# Altium project Goldstrike1_Rev01.PrjPCB (part 2 of 4)

## Sheet GS_02_Pow.SchDoc: Title
size A3; Date: Date; CompanyName: Integrated Micro-Electronics Bulgaria; Organization: Design & Development Department; Address1: Drawing Type; Address2: Address 1; Address3: Address 2; Address4: Address 3; DocumentNumber: 730xxx; Revision: 01; SheetNumber: 1; SheetTotal: 1; PageSetup: Record=PageOptions|CenterHorizontal=True|CenterVertical=True|PrintScale=0.70|XCorrection=1.00|YCorrection=1.00|PrintKind=2|BorderSize=5000000|LeftOffset=0|BottomOffset=0|Orientation=2|PaperLength=1000|PaperWidth=1000|Scale=100|PaperSource=7|PrintQuality=-4|MediaType=1|DitherType=10|PaperKind=A4|PrintScaleMode=1; SheetSize: A3; Time: Time; ModifiedDate: Mod. Date
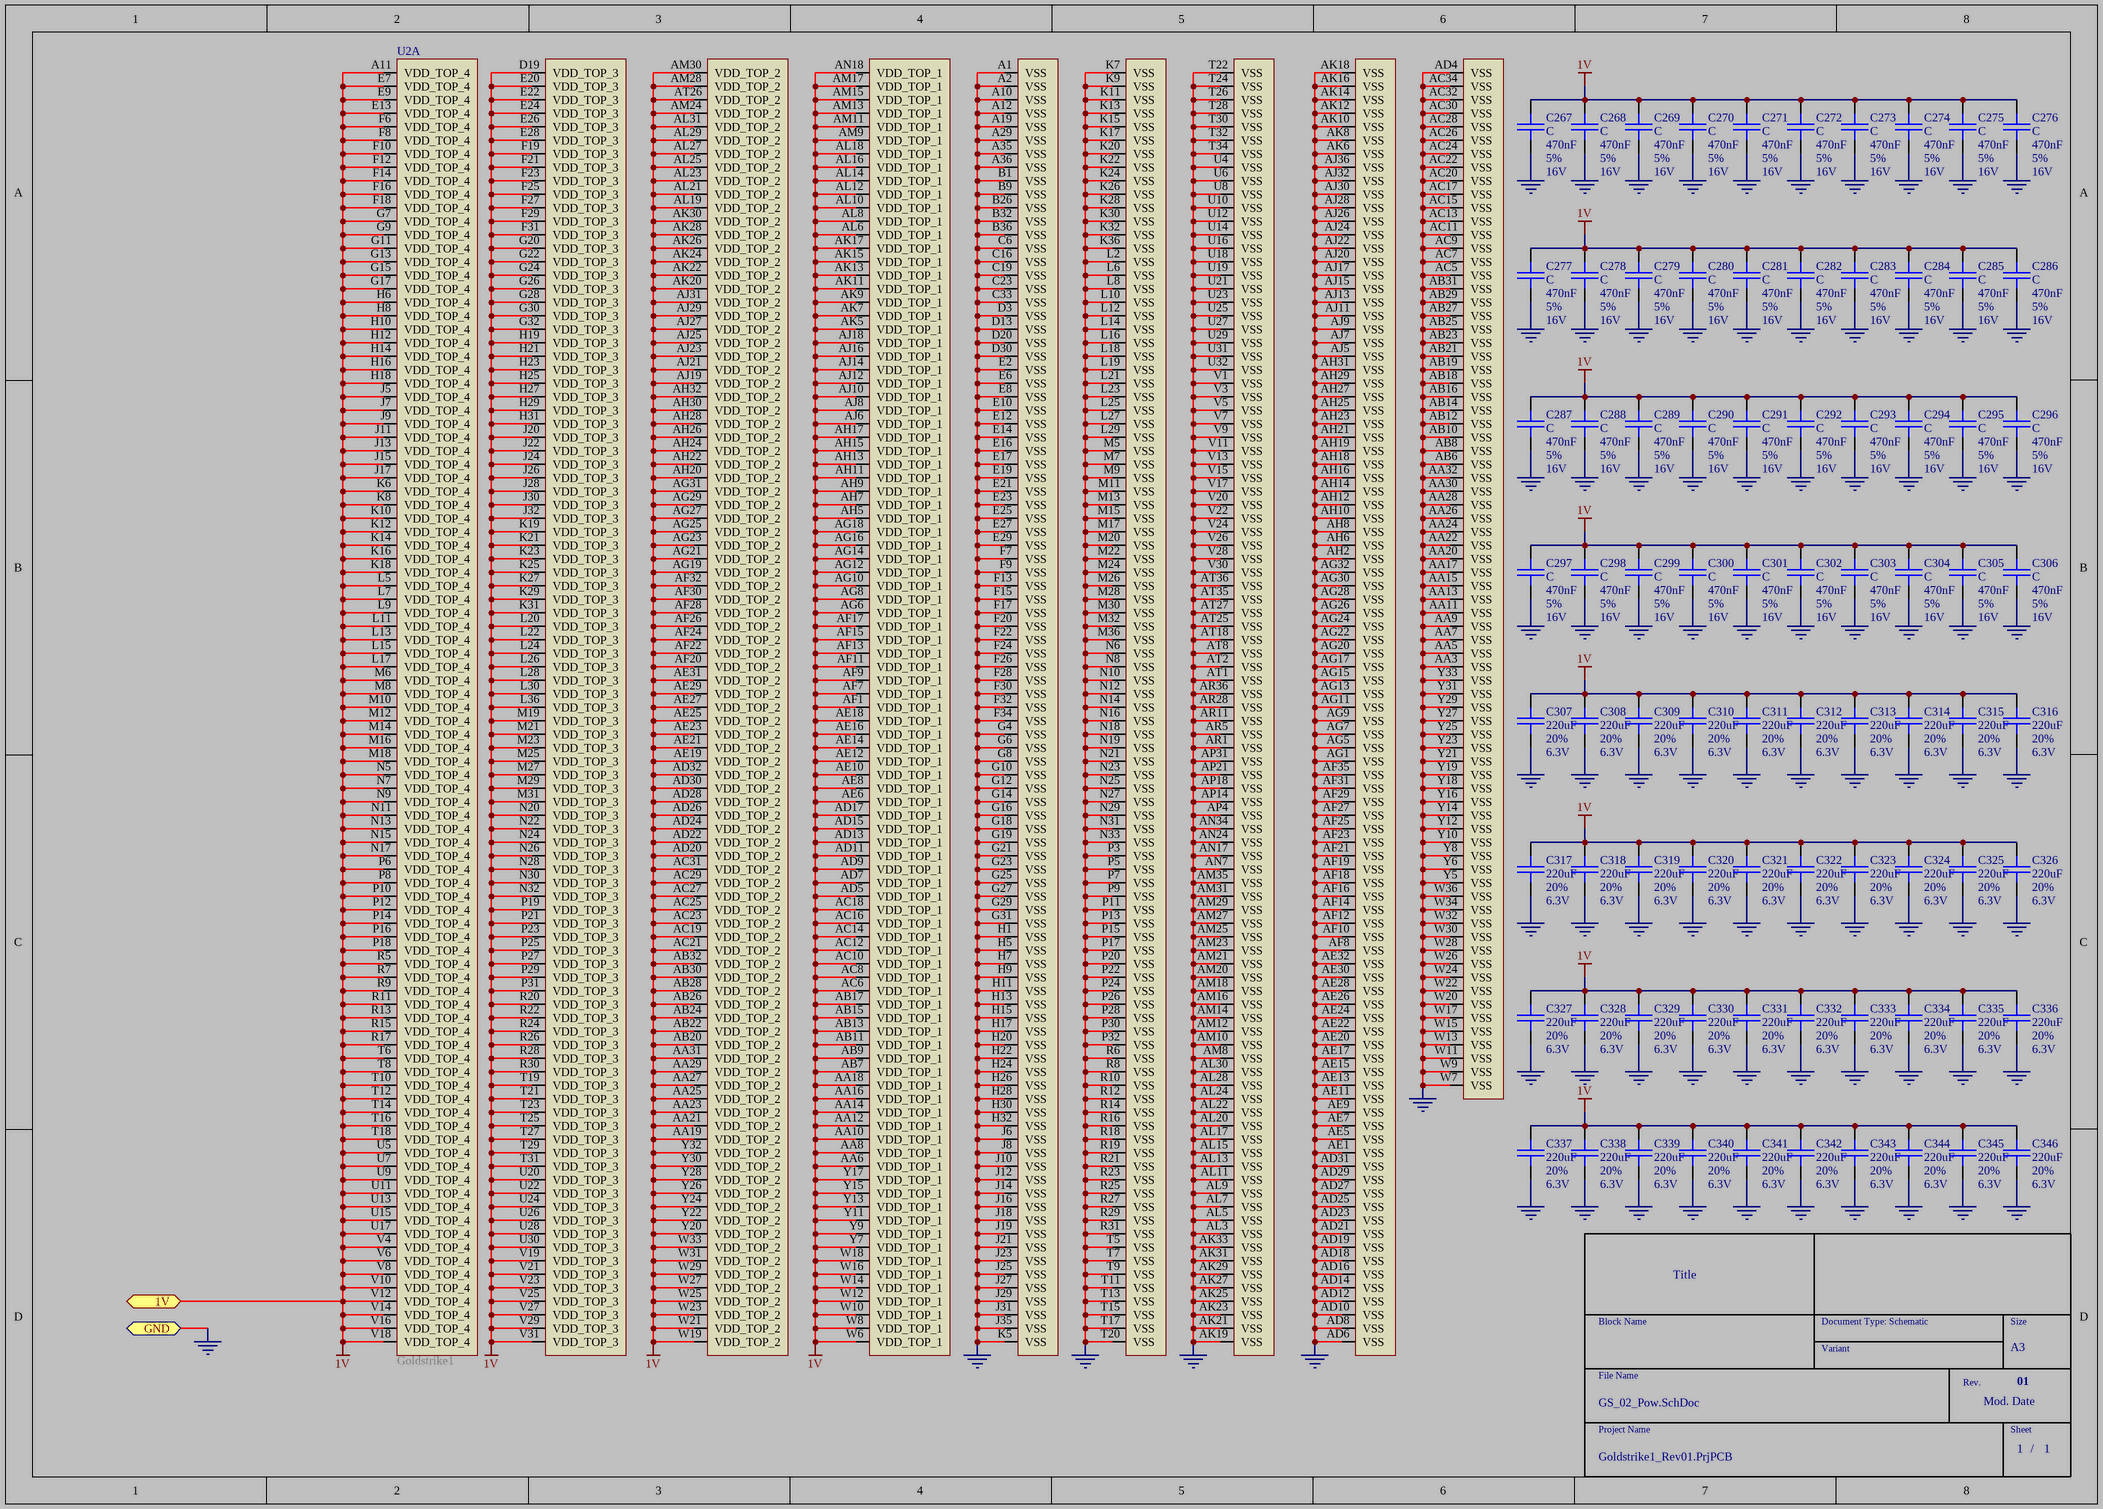
[diagram p3: GS_02_Pow.SchDoc]

### Parts
C267  C  DB_VALUE: 470nF  DB_TOLERANCE: 5%  DB_VOLTAGE: 16V  [SMD_0603_CAPC1608X95N]
C268  C  DB_VALUE: 470nF  DB_TOLERANCE: 5%  DB_VOLTAGE: 16V  [SMD_0603_CAPC1608X95N]
C269  C  DB_VALUE: 470nF  DB_TOLERANCE: 5%  DB_VOLTAGE: 16V  [SMD_0603_CAPC1608X95N]
C270  C  DB_VALUE: 470nF  DB_TOLERANCE: 5%  DB_VOLTAGE: 16V  [SMD_0603_CAPC1608X95N]
C271  C  DB_VALUE: 470nF  DB_TOLERANCE: 5%  DB_VOLTAGE: 16V  [SMD_0603_CAPC1608X95N]
C272  C  DB_VALUE: 470nF  DB_TOLERANCE: 5%  DB_VOLTAGE: 16V  [SMD_0603_CAPC1608X95N]
C273  C  DB_VALUE: 470nF  DB_TOLERANCE: 5%  DB_VOLTAGE: 16V  [SMD_0603_CAPC1608X95N]
C274  C  DB_VALUE: 470nF  DB_TOLERANCE: 5%  DB_VOLTAGE: 16V  [SMD_0603_CAPC1608X95N]
C275  C  DB_VALUE: 470nF  DB_TOLERANCE: 5%  DB_VOLTAGE: 16V  [SMD_0603_CAPC1608X95N]
C276  C  DB_VALUE: 470nF  DB_TOLERANCE: 5%  DB_VOLTAGE: 16V  [SMD_0603_CAPC1608X95N]
C277  C  DB_VALUE: 470nF  DB_TOLERANCE: 5%  DB_VOLTAGE: 16V  [SMD_0603_CAPC1608X95N]
C278  C  DB_VALUE: 470nF  DB_TOLERANCE: 5%  DB_VOLTAGE: 16V  [SMD_0603_CAPC1608X95N]
C279  C  DB_VALUE: 470nF  DB_TOLERANCE: 5%  DB_VOLTAGE: 16V  [SMD_0603_CAPC1608X95N]
C280  C  DB_VALUE: 470nF  DB_TOLERANCE: 5%  DB_VOLTAGE: 16V  [SMD_0603_CAPC1608X95N]
C281  C  DB_VALUE: 470nF  DB_TOLERANCE: 5%  DB_VOLTAGE: 16V  [SMD_0603_CAPC1608X95N]
C282  C  DB_VALUE: 470nF  DB_TOLERANCE: 5%  DB_VOLTAGE: 16V  [SMD_0603_CAPC1608X95N]
C283  C  DB_VALUE: 470nF  DB_TOLERANCE: 5%  DB_VOLTAGE: 16V  [SMD_0603_CAPC1608X95N]
C284  C  DB_VALUE: 470nF  DB_TOLERANCE: 5%  DB_VOLTAGE: 16V  [SMD_0603_CAPC1608X95N]
C285  C  DB_VALUE: 470nF  DB_TOLERANCE: 5%  DB_VOLTAGE: 16V  [SMD_0603_CAPC1608X95N]
C286  C  DB_VALUE: 470nF  DB_TOLERANCE: 5%  DB_VOLTAGE: 16V  [SMD_0603_CAPC1608X95N]
C287  C  DB_VALUE: 470nF  DB_TOLERANCE: 5%  DB_VOLTAGE: 16V  [SMD_0603_CAPC1608X95N]
C288  C  DB_VALUE: 470nF  DB_TOLERANCE: 5%  DB_VOLTAGE: 16V  [SMD_0603_CAPC1608X95N]
C289  C  DB_VALUE: 470nF  DB_TOLERANCE: 5%  DB_VOLTAGE: 16V  [SMD_0603_CAPC1608X95N]
C290  C  DB_VALUE: 470nF  DB_TOLERANCE: 5%  DB_VOLTAGE: 16V  [SMD_0603_CAPC1608X95N]
C291  C  DB_VALUE: 470nF  DB_TOLERANCE: 5%  DB_VOLTAGE: 16V  [SMD_0603_CAPC1608X95N]
C292  C  DB_VALUE: 470nF  DB_TOLERANCE: 5%  DB_VOLTAGE: 16V  [SMD_0603_CAPC1608X95N]
C293  C  DB_VALUE: 470nF  DB_TOLERANCE: 5%  DB_VOLTAGE: 16V  [SMD_0603_CAPC1608X95N]
C294  C  DB_VALUE: 470nF  DB_TOLERANCE: 5%  DB_VOLTAGE: 16V  [SMD_0603_CAPC1608X95N]
C295  C  DB_VALUE: 470nF  DB_TOLERANCE: 5%  DB_VOLTAGE: 16V  [SMD_0603_CAPC1608X95N]
C296  C  DB_VALUE: 470nF  DB_TOLERANCE: 5%  DB_VOLTAGE: 16V  [SMD_0603_CAPC1608X95N]
C297  C  DB_VALUE: 470nF  DB_TOLERANCE: 5%  DB_VOLTAGE: 16V  [SMD_0603_CAPC1608X95N]
C298  C  DB_VALUE: 470nF  DB_TOLERANCE: 5%  DB_VOLTAGE: 16V  [SMD_0603_CAPC1608X95N]
C299  C  DB_VALUE: 470nF  DB_TOLERANCE: 5%  DB_VOLTAGE: 16V  [SMD_0603_CAPC1608X95N]
C300  C  DB_VALUE: 470nF  DB_TOLERANCE: 5%  DB_VOLTAGE: 16V  [SMD_0603_CAPC1608X95N]
C301  C  DB_VALUE: 470nF  DB_TOLERANCE: 5%  DB_VOLTAGE: 16V  [SMD_0603_CAPC1608X95N]
C302  C  DB_VALUE: 470nF  DB_TOLERANCE: 5%  DB_VOLTAGE: 16V  [SMD_0603_CAPC1608X95N]
C303  C  DB_VALUE: 470nF  DB_TOLERANCE: 5%  DB_VOLTAGE: 16V  [SMD_0603_CAPC1608X95N]
C304  C  DB_VALUE: 470nF  DB_TOLERANCE: 5%  DB_VOLTAGE: 16V  [SMD_0603_CAPC1608X95N]
C305  C  DB_VALUE: 470nF  DB_TOLERANCE: 5%  DB_VOLTAGE: 16V  [SMD_0603_CAPC1608X95N]
C306  C  DB_VALUE: 470nF  DB_TOLERANCE: 5%  DB_VOLTAGE: 16V  [SMD_0603_CAPC1608X95N]
C307  DB_VALUE: 220uF  DB_TOLERANCE: 20%  DB_VOLTAGE: 6.3V  [SMD_1210_CAPC3225X279N]  (hidden comment: C)
C308  DB_VALUE: 220uF  DB_TOLERANCE: 20%  DB_VOLTAGE: 6.3V  [SMD_1210_CAPC3225X279N]  (hidden comment: C)
C309  DB_VALUE: 220uF  DB_TOLERANCE: 20%  DB_VOLTAGE: 6.3V  [SMD_1210_CAPC3225X279N]  (hidden comment: C)
C310  DB_VALUE: 220uF  DB_TOLERANCE: 20%  DB_VOLTAGE: 6.3V  [SMD_1210_CAPC3225X279N]  (hidden comment: C)
C311  DB_VALUE: 220uF  DB_TOLERANCE: 20%  DB_VOLTAGE: 6.3V  [SMD_1210_CAPC3225X279N]  (hidden comment: C)
C312  DB_VALUE: 220uF  DB_TOLERANCE: 20%  DB_VOLTAGE: 6.3V  [SMD_1210_CAPC3225X279N]  (hidden comment: C)
C313  DB_VALUE: 220uF  DB_TOLERANCE: 20%  DB_VOLTAGE: 6.3V  [SMD_1210_CAPC3225X279N]  (hidden comment: C)
C314  DB_VALUE: 220uF  DB_TOLERANCE: 20%  DB_VOLTAGE: 6.3V  [SMD_1210_CAPC3225X279N]  (hidden comment: C)
C315  DB_VALUE: 220uF  DB_TOLERANCE: 20%  DB_VOLTAGE: 6.3V  [SMD_1210_CAPC3225X279N]  (hidden comment: C)
C316  DB_VALUE: 220uF  DB_TOLERANCE: 20%  DB_VOLTAGE: 6.3V  [SMD_1210_CAPC3225X279N]  (hidden comment: C)
C317  DB_VALUE: 220uF  DB_TOLERANCE: 20%  DB_VOLTAGE: 6.3V  [SMD_1210_CAPC3225X279N]  (hidden comment: C)
C318  DB_VALUE: 220uF  DB_TOLERANCE: 20%  DB_VOLTAGE: 6.3V  [SMD_1210_CAPC3225X279N]  (hidden comment: C)
C319  DB_VALUE: 220uF  DB_TOLERANCE: 20%  DB_VOLTAGE: 6.3V  [SMD_1210_CAPC3225X279N]  (hidden comment: C)
C320  DB_VALUE: 220uF  DB_TOLERANCE: 20%  DB_VOLTAGE: 6.3V  [SMD_1210_CAPC3225X279N]  (hidden comment: C)
C321  DB_VALUE: 220uF  DB_TOLERANCE: 20%  DB_VOLTAGE: 6.3V  [SMD_1210_CAPC3225X279N]  (hidden comment: C)
C322  DB_VALUE: 220uF  DB_TOLERANCE: 20%  DB_VOLTAGE: 6.3V  [SMD_1210_CAPC3225X279N]  (hidden comment: C)
C323  DB_VALUE: 220uF  DB_TOLERANCE: 20%  DB_VOLTAGE: 6.3V  [SMD_1210_CAPC3225X279N]  (hidden comment: C)
C324  DB_VALUE: 220uF  DB_TOLERANCE: 20%  DB_VOLTAGE: 6.3V  [SMD_1210_CAPC3225X279N]  (hidden comment: C)
C325  DB_VALUE: 220uF  DB_TOLERANCE: 20%  DB_VOLTAGE: 6.3V  [SMD_1210_CAPC3225X279N]  (hidden comment: C)
C326  DB_VALUE: 220uF  DB_TOLERANCE: 20%  DB_VOLTAGE: 6.3V  [SMD_1210_CAPC3225X279N]  (hidden comment: C)
C327  DB_VALUE: 220uF  DB_TOLERANCE: 20%  DB_VOLTAGE: 6.3V  [SMD_1210_CAPC3225X279N]  (hidden comment: C)
C328  DB_VALUE: 220uF  DB_TOLERANCE: 20%  DB_VOLTAGE: 6.3V  [SMD_1210_CAPC3225X279N]  (hidden comment: C)
C329  DB_VALUE: 220uF  DB_TOLERANCE: 20%  DB_VOLTAGE: 6.3V  [SMD_1210_CAPC3225X279N]  (hidden comment: C)
C330  DB_VALUE: 220uF  DB_TOLERANCE: 20%  DB_VOLTAGE: 6.3V  [SMD_1210_CAPC3225X279N]  (hidden comment: C)
C331  DB_VALUE: 220uF  DB_TOLERANCE: 20%  DB_VOLTAGE: 6.3V  [SMD_1210_CAPC3225X279N]  (hidden comment: C)
C332  DB_VALUE: 220uF  DB_TOLERANCE: 20%  DB_VOLTAGE: 6.3V  [SMD_1210_CAPC3225X279N]  (hidden comment: C)
C333  DB_VALUE: 220uF  DB_TOLERANCE: 20%  DB_VOLTAGE: 6.3V  [SMD_1210_CAPC3225X279N]  (hidden comment: C)
C334  DB_VALUE: 220uF  DB_TOLERANCE: 20%  DB_VOLTAGE: 6.3V  [SMD_1210_CAPC3225X279N]  (hidden comment: C)
C335  DB_VALUE: 220uF  DB_TOLERANCE: 20%  DB_VOLTAGE: 6.3V  [SMD_1210_CAPC3225X279N]  (hidden comment: C)
C336  DB_VALUE: 220uF  DB_TOLERANCE: 20%  DB_VOLTAGE: 6.3V  [SMD_1210_CAPC3225X279N]  (hidden comment: C)
C337  DB_VALUE: 220uF  DB_TOLERANCE: 20%  DB_VOLTAGE: 6.3V  [SMD_1210_CAPC3225X279N]  (hidden comment: C)
C338  DB_VALUE: 220uF  DB_TOLERANCE: 20%  DB_VOLTAGE: 6.3V  [SMD_1210_CAPC3225X279N]  (hidden comment: C)
C339  DB_VALUE: 220uF  DB_TOLERANCE: 20%  DB_VOLTAGE: 6.3V  [SMD_1210_CAPC3225X279N]  (hidden comment: C)
C340  DB_VALUE: 220uF  DB_TOLERANCE: 20%  DB_VOLTAGE: 6.3V  [SMD_1210_CAPC3225X279N]  (hidden comment: C)
C341  DB_VALUE: 220uF  DB_TOLERANCE: 20%  DB_VOLTAGE: 6.3V  [SMD_1210_CAPC3225X279N]  (hidden comment: C)
C342  DB_VALUE: 220uF  DB_TOLERANCE: 20%  DB_VOLTAGE: 6.3V  [SMD_1210_CAPC3225X279N]  (hidden comment: C)
C343  DB_VALUE: 220uF  DB_TOLERANCE: 20%  DB_VOLTAGE: 6.3V  [SMD_1210_CAPC3225X279N]  (hidden comment: C)
C344  DB_VALUE: 220uF  DB_TOLERANCE: 20%  DB_VOLTAGE: 6.3V  [SMD_1210_CAPC3225X279N]  (hidden comment: C)
C345  DB_VALUE: 220uF  DB_TOLERANCE: 20%  DB_VOLTAGE: 6.3V  [SMD_1210_CAPC3225X279N]  (hidden comment: C)
C346  DB_VALUE: 220uF  DB_TOLERANCE: 20%  DB_VOLTAGE: 6.3V  [SMD_1210_CAPC3225X279N]  (hidden comment: C)
U2  Goldstrike1  [SMD_BGA1296C100P36X36]  (part A of 5)

### Ports
1V, GND

### Nets
1V: C267.2 C268.2 C269.2 C270.2 C271.2 C272.2 C273.2 C274.2 C275.2 C276.2 C277.2 C278.2 C279.2 C280.2 C281.2 C282.2 C283.2 C284.2 C285.2 C286.2 C287.2 C288.2 C289.2 C290.2 C291.2 C292.2 C293.2 C294.2 C295.2 C296.2 C297.2 C298.2 C299.2 C300.2 C301.2 C302.2 C303.2 C304.2 C305.2 C306.2 C307.2 C308.2 C309.2 C310.2 C311.2 C312.2 C313.2 C314.2 C315.2 C316.2 C317.2 C318.2 C319.2 C320.2 C321.2 C322.2 C323.2 C324.2 C325.2 C326.2 C327.2 C328.2 C329.2 C330.2 C331.2 C332.2 C333.2 C334.2 C335.2 C336.2 C337.2 C338.2 C339.2 C340.2 C341.2 C342.2 C343.2 C344.2 C345.2 C346.2 U2.A11(VDD_TOP_4) U2.AA6(VDD_TOP_1) U2.AA8(VDD_TOP_1) U2.AA10(VDD_TOP_1) U2.AA12(VDD_TOP_1) U2.AA14(VDD_TOP_1) U2.AA16(VDD_TOP_1) U2.AA18(VDD_TOP_1) U2.AA19(VDD_TOP_2) U2.AA21(VDD_TOP_2) U2.AA23(VDD_TOP_2) U2.AA25(VDD_TOP_2) U2.AA27(VDD_TOP_2) U2.AA29(VDD_TOP_2) U2.AA31(VDD_TOP_2) U2.AB7(VDD_TOP_1) U2.AB9(VDD_TOP_1) U2.AB11(VDD_TOP_1) U2.AB13(VDD_TOP_1) U2.AB15(VDD_TOP_1) U2.AB17(VDD_TOP_1) U2.AB20(VDD_TOP_2) U2.AB22(VDD_TOP_2) U2.AB24(VDD_TOP_2) U2.AB26(VDD_TOP_2) U2.AB28(VDD_TOP_2) U2.AB30(VDD_TOP_2) U2.AB32(VDD_TOP_2) U2.AC6(VDD_TOP_1) U2.AC8(VDD_TOP_1) U2.AC10(VDD_TOP_1) U2.AC12(VDD_TOP_1) U2.AC14(VDD_TOP_1) U2.AC16(VDD_TOP_1) U2.AC18(VDD_TOP_1) U2.AC19(VDD_TOP_2) U2.AC21(VDD_TOP_2) U2.AC23(VDD_TOP_2) U2.AC25(VDD_TOP_2) U2.AC27(VDD_TOP_2) U2.AC29(VDD_TOP_2) U2.AC31(VDD_TOP_2) U2.AD5(VDD_TOP_1) U2.AD7(VDD_TOP_1) U2.AD9(VDD_TOP_1) U2.AD11(VDD_TOP_1) U2.AD13(VDD_TOP_1) U2.AD15(VDD_TOP_1) U2.AD17(VDD_TOP_1) U2.AD20(VDD_TOP_2) U2.AD22(VDD_TOP_2) U2.AD24(VDD_TOP_2) U2.AD26(VDD_TOP_2) U2.AD28(VDD_TOP_2) U2.AD30(VDD_TOP_2) U2.AD32(VDD_TOP_2) U2.AE6(VDD_TOP_1) U2.AE8(VDD_TOP_1) U2.AE10(VDD_TOP_1) U2.AE12(VDD_TOP_1) U2.AE14(VDD_TOP_1) U2.AE16(VDD_TOP_1) U2.AE18(VDD_TOP_1) U2.AE19(VDD_TOP_2) U2.AE21(VDD_TOP_2) U2.AE23(VDD_TOP_2) U2.AE25(VDD_TOP_2) U2.AE27(VDD_TOP_2) U2.AE29(VDD_TOP_2) U2.AE31(VDD_TOP_2) U2.AF1(VDD_TOP_1) U2.AF7(VDD_TOP_1) U2.AF9(VDD_TOP_1) U2.AF11(VDD_TOP_1) U2.AF13(VDD_TOP_1) U2.AF15(VDD_TOP_1) U2.AF17(VDD_TOP_1) U2.AF20(VDD_TOP_2) U2.AF22(VDD_TOP_2) U2.AF24(VDD_TOP_2) U2.AF26(VDD_TOP_2) U2.AF28(VDD_TOP_2) U2.AF30(VDD_TOP_2) U2.AF32(VDD_TOP_2) U2.AG6(VDD_TOP_1) U2.AG8(VDD_TOP_1) U2.AG10(VDD_TOP_1) U2.AG12(VDD_TOP_1) U2.AG14(VDD_TOP_1) U2.AG16(VDD_TOP_1) U2.AG18(VDD_TOP_1) U2.AG19(VDD_TOP_2) U2.AG21(VDD_TOP_2) U2.AG23(VDD_TOP_2) U2.AG25(VDD_TOP_2) U2.AG27(VDD_TOP_2) U2.AG29(VDD_TOP_2) U2.AG31(VDD_TOP_2) U2.AH5(VDD_TOP_1) U2.AH7(VDD_TOP_1) U2.AH9(VDD_TOP_1) U2.AH11(VDD_TOP_1) U2.AH13(VDD_TOP_1) U2.AH15(VDD_TOP_1) U2.AH17(VDD_TOP_1) U2.AH20(VDD_TOP_2) U2.AH22(VDD_TOP_2) U2.AH24(VDD_TOP_2) U2.AH26(VDD_TOP_2) U2.AH28(VDD_TOP_2) U2.AH30(VDD_TOP_2) U2.AH32(VDD_TOP_2) U2.AJ6(VDD_TOP_1) U2.AJ8(VDD_TOP_1) U2.AJ10(VDD_TOP_1) U2.AJ12(VDD_TOP_1) U2.AJ14(VDD_TOP_1) U2.AJ16(VDD_TOP_1) U2.AJ18(VDD_TOP_1) U2.AJ19(VDD_TOP_2) U2.AJ21(VDD_TOP_2) U2.AJ23(VDD_TOP_2) U2.AJ25(VDD_TOP_2) U2.AJ27(VDD_TOP_2) U2.AJ29(VDD_TOP_2) U2.AJ31(VDD_TOP_2) U2.AK5(VDD_TOP_1) U2.AK7(VDD_TOP_1) U2.AK9(VDD_TOP_1) U2.AK11(VDD_TOP_1) U2.AK13(VDD_TOP_1) U2.AK15(VDD_TOP_1) U2.AK17(VDD_TOP_1) U2.AK20(VDD_TOP_2) U2.AK22(VDD_TOP_2) U2.AK24(VDD_TOP_2) U2.AK26(VDD_TOP_2) U2.AK28(VDD_TOP_2) U2.AK30(VDD_TOP_2) U2.AL6(VDD_TOP_1) U2.AL8(VDD_TOP_1) U2.AL10(VDD_TOP_1) U2.AL12(VDD_TOP_1) U2.AL14(VDD_TOP_1) U2.AL16(VDD_TOP_1) U2.AL18(VDD_TOP_1) U2.AL19(VDD_TOP_2) U2.AL21(VDD_TOP_2) U2.AL23(VDD_TOP_2) U2.AL25(VDD_TOP_2) U2.AL27(VDD_TOP_2) U2.AL29(VDD_TOP_2) U2.AL31(VDD_TOP_2) U2.AM9(VDD_TOP_1) U2.AM11(VDD_TOP_1) U2.AM13(VDD_TOP_1) U2.AM15(VDD_TOP_1) U2.AM17(VDD_TOP_1) U2.AM24(VDD_TOP_2) U2.AM28(VDD_TOP_2) U2.AM30(VDD_TOP_2) U2.AN18(VDD_TOP_1) U2.AT26(VDD_TOP_2) U2.D19(VDD_TOP_3) U2.E7(VDD_TOP_4) U2.E9(VDD_TOP_4) U2.E13(VDD_TOP_4) U2.E20(VDD_TOP_3) U2.E22(VDD_TOP_3) U2.E24(VDD_TOP_3) U2.E26(VDD_TOP_3) U2.E28(VDD_TOP_3) U2.F6(VDD_TOP_4) U2.F8(VDD_TOP_4) U2.F10(VDD_TOP_4) U2.F12(VDD_TOP_4) U2.F14(VDD_TOP_4) U2.F16(VDD_TOP_4) U2.F18(VDD_TOP_4) U2.F19(VDD_TOP_3) U2.F21(VDD_TOP_3) U2.F23(VDD_TOP_3) U2.F25(VDD_TOP_3) U2.F27(VDD_TOP_3) U2.F29(VDD_TOP_3) U2.F31(VDD_TOP_3) U2.G7(VDD_TOP_4) U2.G9(VDD_TOP_4) U2.G11(VDD_TOP_4) U2.G13(VDD_TOP_4) U2.G15(VDD_TOP_4) U2.G17(VDD_TOP_4) U2.G20(VDD_TOP_3) U2.G22(VDD_TOP_3) U2.G24(VDD_TOP_3) U2.G26(VDD_TOP_3) U2.G28(VDD_TOP_3) U2.G30(VDD_TOP_3) U2.G32(VDD_TOP_3) U2.H6(VDD_TOP_4) U2.H8(VDD_TOP_4) U2.H10(VDD_TOP_4) U2.H12(VDD_TOP_4) U2.H14(VDD_TOP_4) U2.H16(VDD_TOP_4) U2.H18(VDD_TOP_4) U2.H19(VDD_TOP_3) U2.H21(VDD_TOP_3) U2.H23(VDD_TOP_3) U2.H25(VDD_TOP_3) U2.H27(VDD_TOP_3) U2.H29(VDD_TOP_3) U2.H31(VDD_TOP_3) U2.J5(VDD_TOP_4) U2.J7(VDD_TOP_4) U2.J9(VDD_TOP_4) U2.J11(VDD_TOP_4) U2.J13(VDD_TOP_4) U2.J15(VDD_TOP_4) U2.J17(VDD_TOP_4) U2.J20(VDD_TOP_3) U2.J22(VDD_TOP_3) U2.J24(VDD_TOP_3) U2.J26(VDD_TOP_3) U2.J28(VDD_TOP_3) U2.J30(VDD_TOP_3) U2.J32(VDD_TOP_3) U2.K6(VDD_TOP_4) U2.K8(VDD_TOP_4) U2.K10(VDD_TOP_4) U2.K12(VDD_TOP_4) U2.K14(VDD_TOP_4) U2.K16(VDD_TOP_4) U2.K18(VDD_TOP_4) U2.K19(VDD_TOP_3) U2.K21(VDD_TOP_3) U2.K23(VDD_TOP_3) U2.K25(VDD_TOP_3) U2.K27(VDD_TOP_3) U2.K29(VDD_TOP_3) U2.K31(VDD_TOP_3) U2.L5(VDD_TOP_4) U2.L7(VDD_TOP_4) U2.L9(VDD_TOP_4) U2.L11(VDD_TOP_4) U2.L13(VDD_TOP_4) U2.L15(VDD_TOP_4) U2.L17(VDD_TOP_4) U2.L20(VDD_TOP_3) U2.L22(VDD_TOP_3) U2.L24(VDD_TOP_3) U2.L26(VDD_TOP_3) U2.L28(VDD_TOP_3) U2.L30(VDD_TOP_3) U2.L36(VDD_TOP_3) U2.M6(VDD_TOP_4) U2.M8(VDD_TOP_4) U2.M10(VDD_TOP_4) U2.M12(VDD_TOP_4) U2.M14(VDD_TOP_4) U2.M16(VDD_TOP_4) U2.M18(VDD_TOP_4) U2.M19(VDD_TOP_3) U2.M21(VDD_TOP_3) U2.M23(VDD_TOP_3) U2.M25(VDD_TOP_3) U2.M27(VDD_TOP_3) U2.M29(VDD_TOP_3) U2.M31(VDD_TOP_3) U2.N5(VDD_TOP_4) U2.N7(VDD_TOP_4) U2.N9(VDD_TOP_4) U2.N11(VDD_TOP_4) U2.N13(VDD_TOP_4) U2.N15(VDD_TOP_4) U2.N17(VDD_TOP_4) U2.N20(VDD_TOP_3) U2.N22(VDD_TOP_3) U2.N24(VDD_TOP_3) U2.N26(VDD_TOP_3) U2.N28(VDD_TOP_3) U2.N30(VDD_TOP_3) U2.N32(VDD_TOP_3) U2.P6(VDD_TOP_4) U2.P8(VDD_TOP_4) U2.P10(VDD_TOP_4) U2.P12(VDD_TOP_4) U2.P14(VDD_TOP_4) U2.P16(VDD_TOP_4) U2.P18(VDD_TOP_4) U2.P19(VDD_TOP_3) U2.P21(VDD_TOP_3) U2.P23(VDD_TOP_3) U2.P25(VDD_TOP_3) U2.P27(VDD_TOP_3) U2.P29(VDD_TOP_3) U2.P31(VDD_TOP_3) U2.R5(VDD_TOP_4) U2.R7(VDD_TOP_4) U2.R9(VDD_TOP_4) U2.R11(VDD_TOP_4) U2.R13(VDD_TOP_4) U2.R15(VDD_TOP_4) U2.R17(VDD_TOP_4) U2.R20(VDD_TOP_3) U2.R22(VDD_TOP_3) U2.R24(VDD_TOP_3) U2.R26(VDD_TOP_3) U2.R28(VDD_TOP_3) U2.R30(VDD_TOP_3) U2.T6(VDD_TOP_4) U2.T8(VDD_TOP_4) U2.T10(VDD_TOP_4) U2.T12(VDD_TOP_4) U2.T14(VDD_TOP_4) U2.T16(VDD_TOP_4) U2.T18(VDD_TOP_4) U2.T19(VDD_TOP_3) U2.T21(VDD_TOP_3) U2.T23(VDD_TOP_3) U2.T25(VDD_TOP_3) U2.T27(VDD_TOP_3) U2.T29(VDD_TOP_3) U2.T31(VDD_TOP_3) U2.U5(VDD_TOP_4) U2.U7(VDD_TOP_4) U2.U9(VDD_TOP_4) U2.U11(VDD_TOP_4) U2.U13(VDD_TOP_4) U2.U15(VDD_TOP_4) U2.U17(VDD_TOP_4) U2.U20(VDD_TOP_3) U2.U22(VDD_TOP_3) U2.U24(VDD_TOP_3) U2.U26(VDD_TOP_3) U2.U28(VDD_TOP_3) U2.U30(VDD_TOP_3) U2.V4(VDD_TOP_4) U2.V6(VDD_TOP_4) U2.V8(VDD_TOP_4) U2.V10(VDD_TOP_4) U2.V12(VDD_TOP_4) U2.V14(VDD_TOP_4) U2.V16(VDD_TOP_4) U2.V18(VDD_TOP_4) U2.V19(VDD_TOP_3) U2.V21(VDD_TOP_3) U2.V23(VDD_TOP_3) U2.V25(VDD_TOP_3) U2.V27(VDD_TOP_3) U2.V29(VDD_TOP_3) U2.V31(VDD_TOP_3) U2.W6(VDD_TOP_1) U2.W8(VDD_TOP_1) U2.W10(VDD_TOP_1) U2.W12(VDD_TOP_1) U2.W14(VDD_TOP_1) U2.W16(VDD_TOP_1) U2.W18(VDD_TOP_1) U2.W19(VDD_TOP_2) U2.W21(VDD_TOP_2) U2.W23(VDD_TOP_2) U2.W25(VDD_TOP_2) U2.W27(VDD_TOP_2) U2.W29(VDD_TOP_2) U2.W31(VDD_TOP_2) U2.W33(VDD_TOP_2) U2.Y7(VDD_TOP_1) U2.Y9(VDD_TOP_1) U2.Y11(VDD_TOP_1) U2.Y13(VDD_TOP_1) U2.Y15(VDD_TOP_1) U2.Y17(VDD_TOP_1) U2.Y20(VDD_TOP_2) U2.Y22(VDD_TOP_2) U2.Y24(VDD_TOP_2) U2.Y26(VDD_TOP_2) U2.Y28(VDD_TOP_2) U2.Y30(VDD_TOP_2) U2.Y32(VDD_TOP_2) ; port 1V
GND: C267.1 C268.1 C269.1 C270.1 C271.1 C272.1 C273.1 C274.1 C275.1 C276.1 C277.1 C278.1 C279.1 C280.1 C281.1 C282.1 C283.1 C284.1 C285.1 C286.1 C287.1 C288.1 C289.1 C290.1 C291.1 C292.1 C293.1 C294.1 C295.1 C296.1 C297.1 C298.1 C299.1 C300.1 C301.1 C302.1 C303.1 C304.1 C305.1 C306.1 C307.1 C308.1 C309.1 C310.1 C311.1 C312.1 C313.1 C314.1 C315.1 C316.1 C317.1 C318.1 C319.1 C320.1 C321.1 C322.1 C323.1 C324.1 C325.1 C326.1 C327.1 C328.1 C329.1 C330.1 C331.1 C332.1 C333.1 C334.1 C335.1 C336.1 C337.1 C338.1 C339.1 C340.1 C341.1 C342.1 C343.1 C344.1 C345.1 C346.1 U2.A1(VSS) U2.A2(VSS) U2.A10(VSS) U2.A12(VSS) U2.A19(VSS) U2.A29(VSS) U2.A35(VSS) U2.A36(VSS) U2.AA3(VSS) U2.AA5(VSS) U2.AA7(VSS) U2.AA9(VSS) U2.AA11(VSS) U2.AA13(VSS) U2.AA15(VSS) U2.AA17(VSS) U2.AA20(VSS) U2.AA22(VSS) U2.AA24(VSS) U2.AA26(VSS) U2.AA28(VSS) U2.AA30(VSS) U2.AA32(VSS) U2.AB6(VSS) U2.AB8(VSS) U2.AB10(VSS) U2.AB12(VSS) U2.AB14(VSS) U2.AB16(VSS) U2.AB18(VSS) U2.AB19(VSS) U2.AB21(VSS) U2.AB23(VSS) U2.AB25(VSS) U2.AB27(VSS) U2.AB29(VSS) U2.AB31(VSS) U2.AC5(VSS) U2.AC7(VSS) U2.AC9(VSS) U2.AC11(VSS) U2.AC13(VSS) U2.AC15(VSS) U2.AC17(VSS) U2.AC20(VSS) U2.AC22(VSS) U2.AC24(VSS) U2.AC26(VSS) U2.AC28(VSS) U2.AC30(VSS) U2.AC32(VSS) U2.AC34(VSS) U2.AD4(VSS) U2.AD6(VSS) U2.AD8(VSS) U2.AD10(VSS) U2.AD12(VSS) U2.AD14(VSS) U2.AD16(VSS) U2.AD18(VSS) U2.AD19(VSS) U2.AD21(VSS) U2.AD23(VSS) U2.AD25(VSS) U2.AD27(VSS) U2.AD29(VSS) U2.AD31(VSS) U2.AE1(VSS) U2.AE5(VSS) U2.AE7(VSS) U2.AE9(VSS) U2.AE11(VSS) U2.AE13(VSS) U2.AE15(VSS) U2.AE17(VSS) U2.AE20(VSS) U2.AE22(VSS) U2.AE24(VSS) U2.AE26(VSS) U2.AE28(VSS) U2.AE30(VSS) U2.AE32(VSS) U2.AF8(VSS) U2.AF10(VSS) U2.AF12(VSS) U2.AF14(VSS) U2.AF16(VSS) U2.AF18(VSS) U2.AF19(VSS) U2.AF21(VSS) U2.AF23(VSS) U2.AF25(VSS) U2.AF27(VSS) U2.AF29(VSS) U2.AF31(VSS) U2.AF35(VSS) U2.AG1(VSS) U2.AG5(VSS) U2.AG7(VSS) U2.AG9(VSS) U2.AG11(VSS) U2.AG13(VSS) U2.AG15(VSS) U2.AG17(VSS) U2.AG20(VSS) U2.AG22(VSS) U2.AG24(VSS) U2.AG26(VSS) U2.AG28(VSS) U2.AG30(VSS) U2.AG32(VSS) U2.AH2(VSS) U2.AH6(VSS) U2.AH8(VSS) U2.AH10(VSS) U2.AH12(VSS) U2.AH14(VSS) U2.AH16(VSS) U2.AH18(VSS) U2.AH19(VSS) U2.AH21(VSS) U2.AH23(VSS) U2.AH25(VSS) U2.AH27(VSS) U2.AH29(VSS) U2.AH31(VSS) U2.AJ5(VSS) U2.AJ7(VSS) U2.AJ9(VSS) U2.AJ11(VSS) U2.AJ13(VSS) U2.AJ15(VSS) U2.AJ17(VSS) U2.AJ20(VSS) U2.AJ22(VSS) U2.AJ24(VSS) U2.AJ26(VSS) U2.AJ28(VSS) U2.AJ30(VSS) U2.AJ32(VSS) U2.AJ36(VSS) U2.AK6(VSS) U2.AK8(VSS) U2.AK10(VSS) U2.AK12(VSS) U2.AK14(VSS) U2.AK16(VSS) U2.AK18(VSS) U2.AK19(VSS) U2.AK21(VSS) U2.AK23(VSS) U2.AK25(VSS) U2.AK27(VSS) U2.AK29(VSS) U2.AK31(VSS) U2.AK33(VSS) U2.AL3(VSS) U2.AL5(VSS) U2.AL7(VSS) U2.AL9(VSS) U2.AL11(VSS) U2.AL13(VSS) U2.AL15(VSS) U2.AL17(VSS) U2.AL20(VSS) U2.AL22(VSS) U2.AL24(VSS) U2.AL28(VSS) U2.AL30(VSS) U2.AM8(VSS) U2.AM10(VSS) U2.AM12(VSS) U2.AM14(VSS) U2.AM16(VSS) U2.AM18(VSS) U2.AM20(VSS) U2.AM21(VSS) U2.AM23(VSS) U2.AM25(VSS) U2.AM27(VSS) U2.AM29(VSS) U2.AM31(VSS) U2.AM35(VSS) U2.AN7(VSS) U2.AN17(VSS) U2.AN24(VSS) U2.AN34(VSS) U2.AP4(VSS) U2.AP14(VSS) U2.AP18(VSS) U2.AP21(VSS) U2.AP31(VSS) U2.AR1(VSS) U2.AR5(VSS) U2.AR11(VSS) U2.AR28(VSS) U2.AR36(VSS) U2.AT1(VSS) U2.AT2(VSS) U2.AT8(VSS) U2.AT18(VSS) U2.AT25(VSS) U2.AT27(VSS) U2.AT35(VSS) U2.AT36(VSS) U2.B1(VSS) U2.B9(VSS) U2.B26(VSS) U2.B32(VSS) U2.B36(VSS) U2.C6(VSS) U2.C16(VSS) U2.C19(VSS) U2.C23(VSS) U2.C33(VSS) U2.D3(VSS) U2.D13(VSS) U2.D20(VSS) U2.D30(VSS) U2.E2(VSS) U2.E6(VSS) U2.E8(VSS) U2.E10(VSS) U2.E12(VSS) U2.E14(VSS) U2.E16(VSS) U2.E17(VSS) U2.E19(VSS) U2.E21(VSS) U2.E23(VSS) U2.E25(VSS) U2.E27(VSS) U2.E29(VSS) U2.F7(VSS) U2.F9(VSS) U2.F13(VSS) U2.F15(VSS) U2.F17(VSS) U2.F20(VSS) U2.F22(VSS) U2.F24(VSS) U2.F26(VSS) U2.F28(VSS) U2.F30(VSS) U2.F32(VSS) U2.F34(VSS) U2.G4(VSS) U2.G6(VSS) U2.G8(VSS) U2.G10(VSS) U2.G12(VSS) U2.G14(VSS) U2.G16(VSS) U2.G18(VSS) U2.G19(VSS) U2.G21(VSS) U2.G23(VSS) U2.G25(VSS) U2.G27(VSS) U2.G29(VSS) U2.G31(VSS) U2.H1(VSS) U2.H5(VSS) U2.H7(VSS) U2.H9(VSS) U2.H11(VSS) U2.H13(VSS) U2.H15(VSS) U2.H17(VSS) U2.H20(VSS) U2.H22(VSS) U2.H24(VSS) U2.H26(VSS) U2.H28(VSS) U2.H30(VSS) U2.H32(VSS) U2.J6(VSS) U2.J8(VSS) U2.J10(VSS) U2.J12(VSS) U2.J14(VSS) U2.J16(VSS) U2.J18(VSS) U2.J19(VSS) U2.J21(VSS) U2.J23(VSS) U2.J25(VSS) U2.J27(VSS) U2.J29(VSS) U2.J31(VSS) U2.J35(VSS) U2.K5(VSS) U2.K7(VSS) U2.K9(VSS) U2.K11(VSS) U2.K13(VSS) U2.K15(VSS) U2.K17(VSS) U2.K20(VSS) U2.K22(VSS) U2.K24(VSS) U2.K26(VSS) U2.K28(VSS) U2.K30(VSS) U2.K32(VSS) U2.K36(VSS) U2.L2(VSS) U2.L6(VSS) U2.L8(VSS) U2.L10(VSS) U2.L12(VSS) U2.L14(VSS) U2.L16(VSS) U2.L18(VSS) U2.L19(VSS) U2.L21(VSS) U2.L23(VSS) U2.L25(VSS) U2.L27(VSS) U2.L29(VSS) U2.M5(VSS) U2.M7(VSS) U2.M9(VSS) U2.M11(VSS) U2.M13(VSS) U2.M15(VSS) U2.M17(VSS) U2.M20(VSS) U2.M22(VSS) U2.M24(VSS) U2.M26(VSS) U2.M28(VSS) U2.M30(VSS) U2.M32(VSS) U2.M36(VSS) U2.N6(VSS) U2.N8(VSS) U2.N10(VSS) U2.N12(VSS) U2.N14(VSS) U2.N16(VSS) U2.N18(VSS) U2.N19(VSS) U2.N21(VSS) U2.N23(VSS) U2.N25(VSS) U2.N27(VSS) U2.N29(VSS) U2.N31(VSS) U2.N33(VSS) U2.P3(VSS) U2.P5(VSS) U2.P7(VSS) U2.P9(VSS) U2.P11(VSS) U2.P13(VSS) U2.P15(VSS) U2.P17(VSS) U2.P20(VSS) U2.P22(VSS) U2.P24(VSS) U2.P26(VSS) U2.P28(VSS) U2.P30(VSS) U2.P32(VSS) U2.R6(VSS) U2.R8(VSS) U2.R10(VSS) U2.R12(VSS) U2.R14(VSS) U2.R16(VSS) U2.R18(VSS) U2.R19(VSS) U2.R21(VSS) U2.R23(VSS) U2.R25(VSS) U2.R27(VSS) U2.R29(VSS) U2.R31(VSS) U2.T5(VSS) U2.T7(VSS) U2.T9(VSS) U2.T11(VSS) U2.T13(VSS) U2.T15(VSS) U2.T17(VSS) U2.T20(VSS) U2.T22(VSS) U2.T24(VSS) U2.T26(VSS) U2.T28(VSS) U2.T30(VSS) U2.T32(VSS) U2.T34(VSS) U2.U4(VSS) U2.U6(VSS) U2.U8(VSS) U2.U10(VSS) U2.U12(VSS) U2.U14(VSS) U2.U16(VSS) U2.U18(VSS) U2.U19(VSS) U2.U21(VSS) U2.U23(VSS) U2.U25(VSS) U2.U27(VSS) U2.U29(VSS) U2.U31(VSS) U2.U32(VSS) U2.V1(VSS) U2.V3(VSS) U2.V5(VSS) U2.V7(VSS) U2.V9(VSS) U2.V11(VSS) U2.V13(VSS) U2.V15(VSS) U2.V17(VSS) U2.V20(VSS) U2.V22(VSS) U2.V24(VSS) U2.V26(VSS) U2.V28(VSS) U2.V30(VSS) U2.W7(VSS) U2.W9(VSS) U2.W11(VSS) U2.W13(VSS) U2.W15(VSS) U2.W17(VSS) U2.W20(VSS) U2.W22(VSS) U2.W24(VSS) U2.W26(VSS) U2.W28(VSS) U2.W30(VSS) U2.W32(VSS) U2.W34(VSS) U2.W36(VSS) U2.Y5(VSS) U2.Y6(VSS) U2.Y8(VSS) U2.Y10(VSS) U2.Y12(VSS) U2.Y14(VSS) U2.Y16(VSS) U2.Y18(VSS) U2.Y19(VSS) U2.Y21(VSS) U2.Y23(VSS) U2.Y25(VSS) U2.Y27(VSS) U2.Y29(VSS) U2.Y31(VSS) U2.Y33(VSS) ; port GND

### Notes on the sheet
- Block Name
- Document Type: Schematic
- Size
- File Name
- Variant
- Rev.
- Project Name
- Sheet
- /

### Library data of the parts
C267-C306 = CAP000028169: DB_PART_TYPE: Ceramic_SMD\Standard_X7R; DB_MANUFACTURER_PART: KEMET    C0603C474J4RAC; NOTE: <NOTE>; DB_T_RANGE: -55 to 125; DB_PACKAGE: 0603; DB_DESCRIPTION: C X7R 470nF 5% 16V 0603; DB_APPROVED_ON: 09.10.2010 г.; DB_STATUS: NEW; DB_PART_NUMBER: CAP000028169; DB_PCB_DEVICE: SMD_0603_CAPC1608X95N; DB_DATASHEET: http://john.epiqdesign.com/projects/CIS_Datasheets/F3102_CE_Kemet.pdf?rev=92&sc=0
C307-C346 = CAP000047355: DB_PART_TYPE: Ceramic_SMD\Standard_X5R; DB_MANUFACTURER_PART: SAMSUNG    CL32A227MQVNNNE; NOTE: <NOTE>; DB_T_RANGE: -55 to 85; DB_PACKAGE: 1210; DB_DESCRIPTION: C X5R 220uF 20% 6.3V 1210; DB_APPROVED_BY: VSN; DB_APPROVED_ON: 07.5.2014 г. 11:28:08; DB_STATUS: NEW; DB_PART_NUMBER: CAP000047355; DB_PCB_DEVICE: SMD_1210_CAPC3225X279N; DB_DATASHEET: http://john.epiqdesign.com/projects/CIS_Datasheets/CAP_CL32A227MQVNNNE.pdf?rev=1401&sc=0
U2 = Goldstrike1: DB_PCB_DEVICE: SMD_BGA1296C100P36X36

## Sheet MCU.SchDoc: Title
size A2; Date: Date; CompanyName: Integrated Micro-Electronics Bulgaria; Organization: Design & Development Department; Address1: Drawing Type; Address2: Address 1; Address3: Address 2; Address4: Address 3; DocumentNumber: 730xxx; Revision: 01; SheetNumber: 1; SheetTotal: 1; PageSetup: Record=PageOptions|CenterHorizontal=True|CenterVertical=True|PrintScale=0.70|XCorrection=1.00|YCorrection=1.00|PrintKind=2|BorderSize=5000000|LeftOffset=0|BottomOffset=0|Orientation=2|PaperLength=1000|PaperWidth=1000|Scale=100|PaperSource=7|PrintQuality=-4|MediaType=1|DitherType=10|PaperKind=A4|PrintScaleMode=1; SheetSize: A3; Time: Time; ModifiedDate: Mod. Date
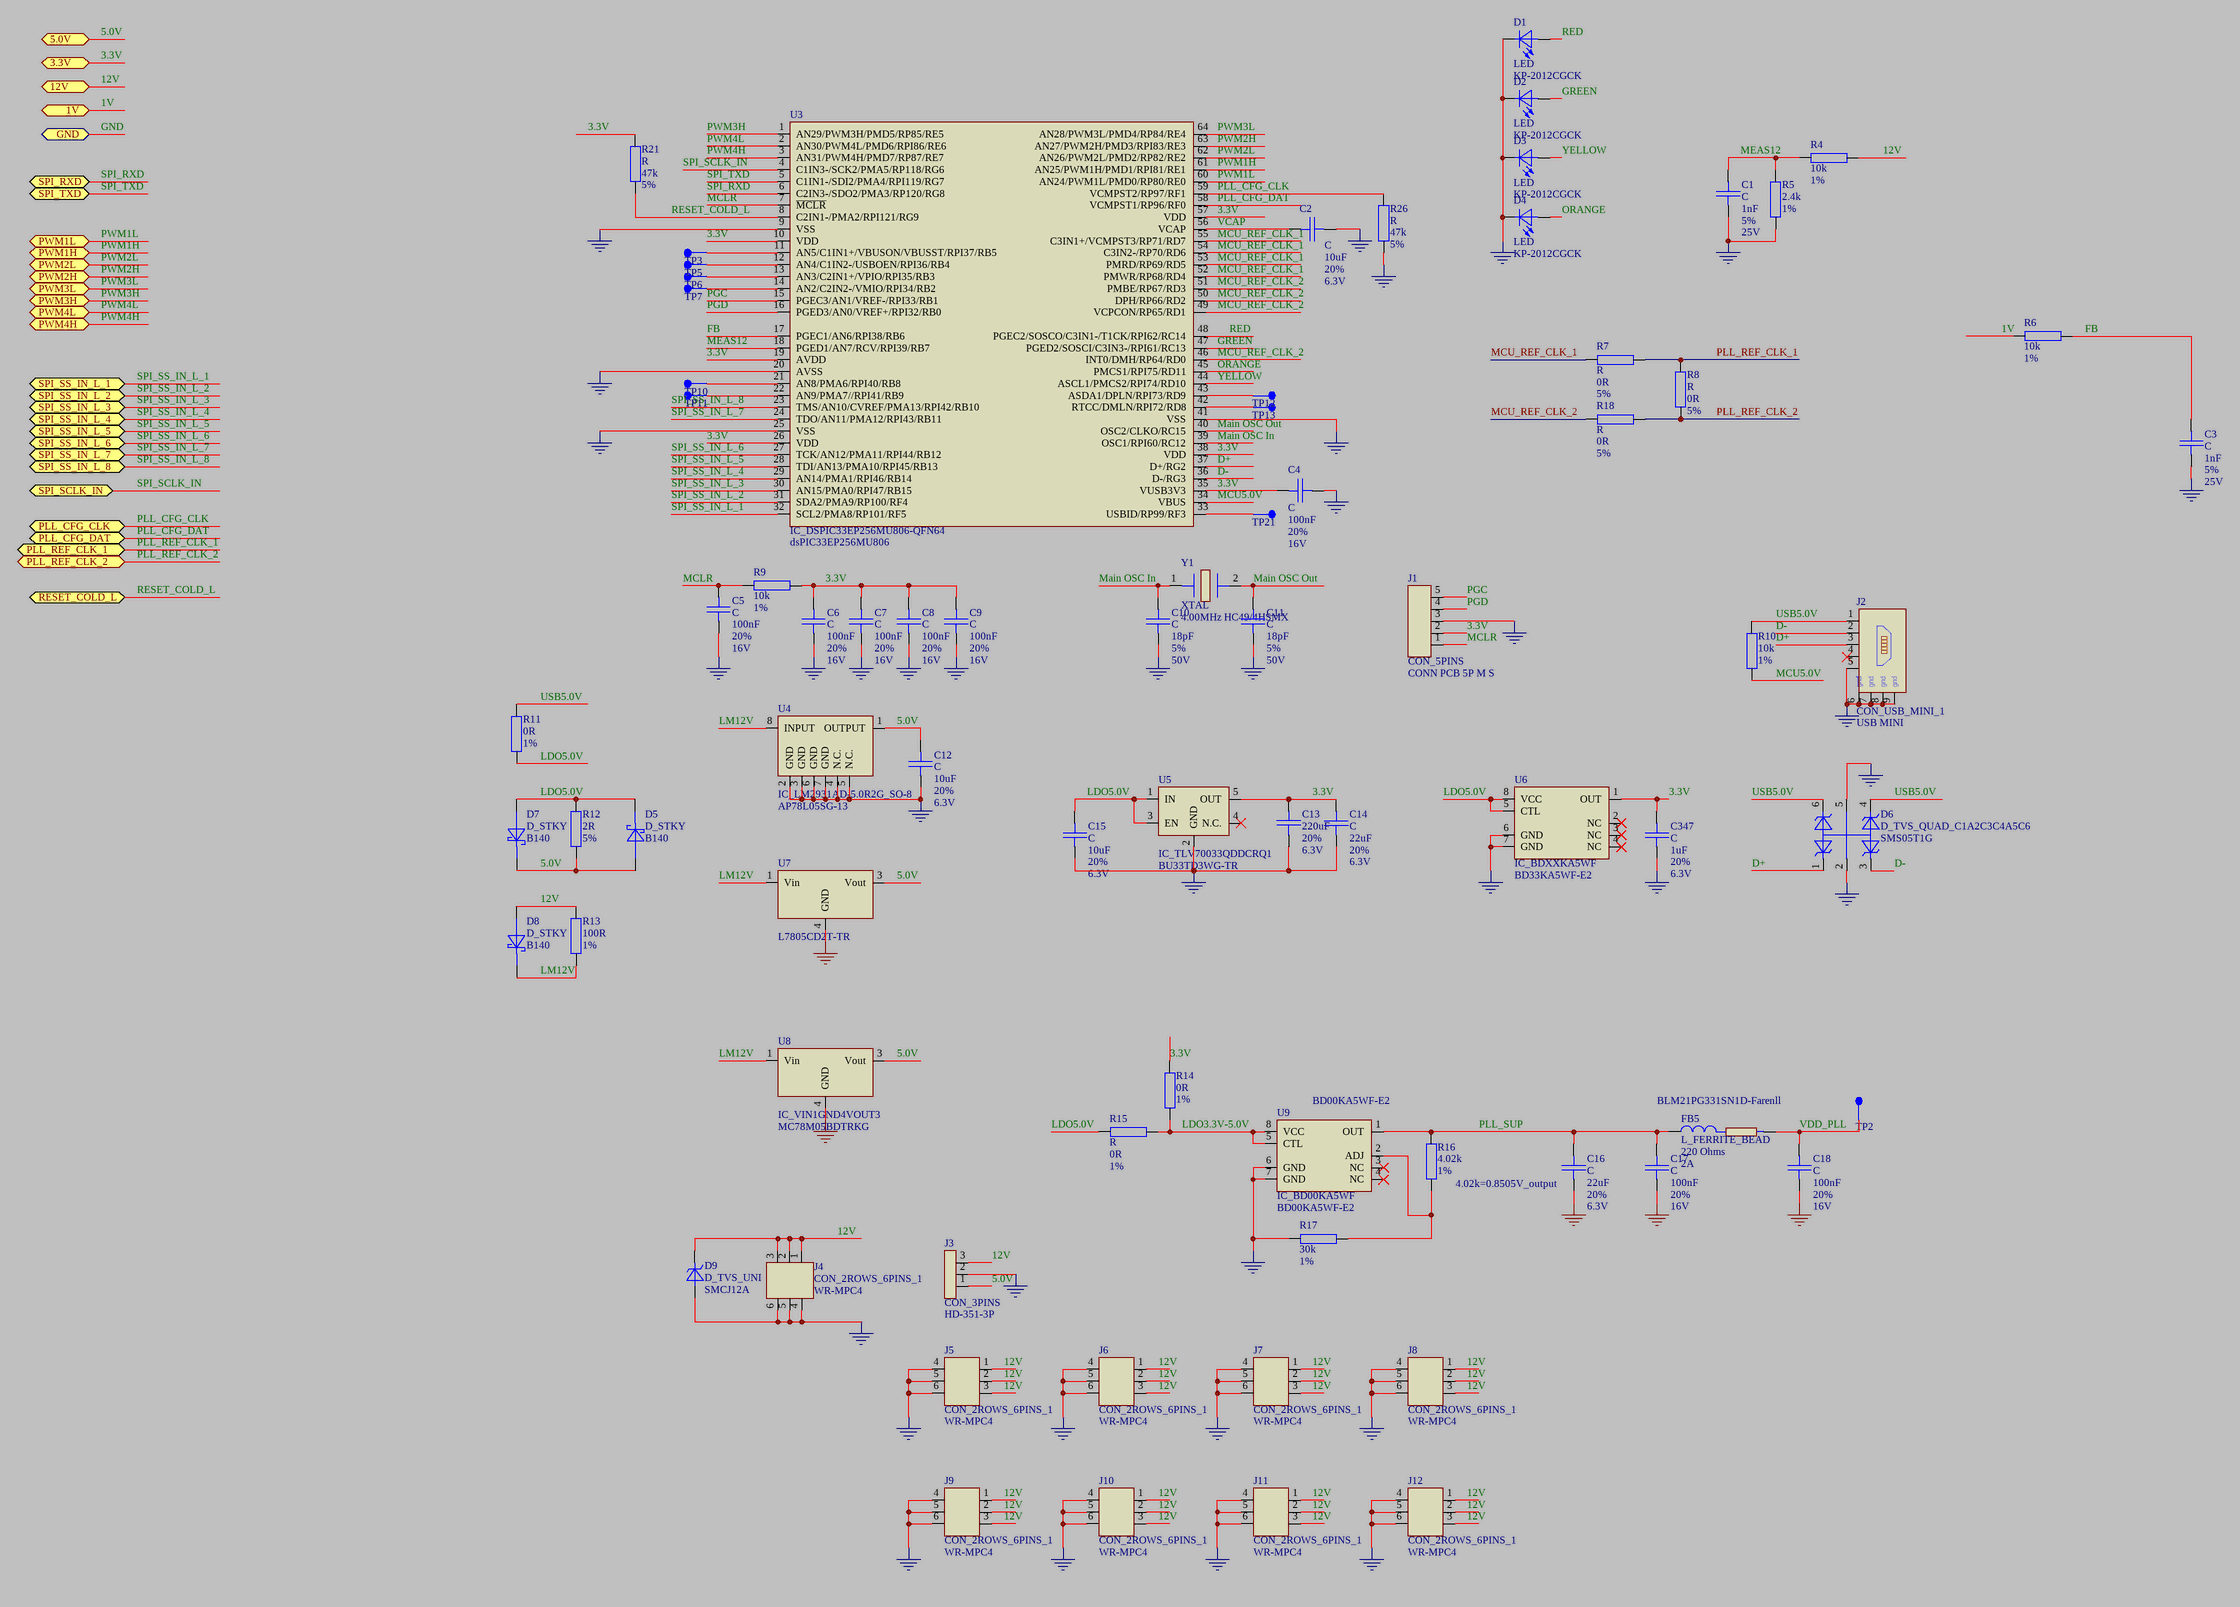
[diagram p4: MCU.SchDoc]

### Parts
C1  C  DB_VALUE: 1nF  DB_TOLERANCE: 5%  DB_VOLTAGE: 25V  [SMD_0603_CAPC1608X95N]
C2  C  DB_VALUE: 10uF  DB_TOLERANCE: 20%  DB_VOLTAGE: 6.3V  [SMD_0603_CAPC1608X95N]
C3  C  DB_VALUE: 1nF  DB_TOLERANCE: 5%  DB_VOLTAGE: 25V  [SMD_0603_CAPC1608X95N]
C4  C  DB_VALUE: 100nF  DB_TOLERANCE: 20%  DB_VOLTAGE: 16V  [SMD_0402_CAPC1005X55N]
C5  C  DB_VALUE: 100nF  DB_TOLERANCE: 20%  DB_VOLTAGE: 16V  [SMD_0402_CAPC1005X55N]
C6  C  DB_VALUE: 100nF  DB_TOLERANCE: 20%  DB_VOLTAGE: 16V  [SMD_0402_CAPC1005X55N]
C7  C  DB_VALUE: 100nF  DB_TOLERANCE: 20%  DB_VOLTAGE: 16V  [SMD_0402_CAPC1005X55N]
C8  C  DB_VALUE: 100nF  DB_TOLERANCE: 20%  DB_VOLTAGE: 16V  [SMD_0402_CAPC1005X55N]
C9  C  DB_VALUE: 100nF  DB_TOLERANCE: 20%  DB_VOLTAGE: 16V  [SMD_0402_CAPC1005X55N]
C10  C  DB_VALUE: 18pF  DB_TOLERANCE: 5%  DB_VOLTAGE: 50V  [SMD_0603_CAPC1608X95N]
C11  C  DB_VALUE: 18pF  DB_TOLERANCE: 5%  DB_VOLTAGE: 50V  [SMD_0603_CAPC1608X95N]
C12  C  DB_VALUE: 10uF  DB_TOLERANCE: 20%  DB_VOLTAGE: 6.3V  [SMD_0603_CAPC1608X95N]
C13  DB_VALUE: 220uF  DB_TOLERANCE: 20%  DB_VOLTAGE: 6.3V  [SMD_1210_CAPC3225X279N]  (hidden comment: C)
C14  C  DB_VALUE: 22uF  DB_TOLERANCE: 20%  DB_VOLTAGE: 6.3V  [SMD_0805_CAPC2012X145N]
C15  C  DB_VALUE: 10uF  DB_TOLERANCE: 20%  DB_VOLTAGE: 6.3V  [SMD_0603_CAPC1608X95N]
C16  C  DB_VALUE: 22uF  DB_TOLERANCE: 20%  DB_VOLTAGE: 6.3V  [SMD_0805_CAPC2012X145N]
C17  C  DB_VALUE: 100nF  DB_TOLERANCE: 20%  DB_VOLTAGE: 16V  [SMD_0402_CAPC1005X55N]
C18  C  DB_VALUE: 100nF  DB_TOLERANCE: 20%  DB_VOLTAGE: 16V  [SMD_0402_CAPC1005X55N]
C347  C  DB_VALUE: 1uF  DB_TOLERANCE: 20%  DB_VOLTAGE: 6.3V  [SMD_0603_CAPC1608X95N]
D1  LED  DB_VALUE: KP-2012CGCK  [SMD_0805_LED2012X100N]
D2  LED  DB_VALUE: KP-2012CGCK  [SMD_0805_LED2012X100N]
D3  LED  DB_VALUE: KP-2012CGCK  [SMD_0805_LED2012X100N]
D4  LED  DB_VALUE: KP-2012CGCK  [SMD_0805_LED2012X100N]
D5  D_STKY  DB_VALUE: B140  [SMD_DO214AC_SMA]
D6  D_TVS_QUAD_C1A2C3C4A5C6  DB_VALUE: SMS05T1G  [SMD_SOT457_SOT95P275X110-6N]
D7  D_STKY  DB_VALUE: B140  [SMD_DO214AC_SMA]
D8  D_STKY  DB_VALUE: B140  [SMD_DO214AC_SMA]
D9  D_TVS_UNI  DB_VALUE: SMCJ12A  [SMD_DO214AC_SMC]
FB5  L_FERRITE_BEAD  DB_VALUE: 220 Ohms  DB_CURRENT: 2A  [SMD_0805_INDC2012X105N]
J1  CON_5PINS  DB_VALUE: CONN PCB 5P M S  [PTH_HDRV05W64P254_1X05]
J2  CON_USB_MINI_1  DB_VALUE: USB MINI  [SMD_CON-CVILUX-CU04-SCM15B0]
J3  CON_3PINS  DB_VALUE: HD-351-3P  [PTH_CON_HD-351-3P]
J4  CON_2ROWS_6PINS_1  DB_VALUE: WR-MPC4  [PTH_CON_WR-MRC4-6P_S]
J5  CON_2ROWS_6PINS_1  DB_VALUE: WR-MPC4  [PTH_CON_WR-MRC4-6P_S]
J6  CON_2ROWS_6PINS_1  DB_VALUE: WR-MPC4  [PTH_CON_WR-MRC4-6P_S]
J7  CON_2ROWS_6PINS_1  DB_VALUE: WR-MPC4  [PTH_CON_WR-MRC4-6P_S]
J8  CON_2ROWS_6PINS_1  DB_VALUE: WR-MPC4  [PTH_CON_WR-MRC4-6P_S]
J9  CON_2ROWS_6PINS_1  DB_VALUE: WR-MPC4  [PTH_CON_WR-MRC4-6P_S]
J10  CON_2ROWS_6PINS_1  DB_VALUE: WR-MPC4  [PTH_CON_WR-MRC4-6P_S]
J11  CON_2ROWS_6PINS_1  DB_VALUE: WR-MPC4  [PTH_CON_WR-MRC4-6P_S]
J12  CON_2ROWS_6PINS_1  DB_VALUE: WR-MPC4  [PTH_CON_WR-MRC4-6P_S]
R4  DB_VALUE: 10k  DB_TOLERANCE: 1%  [SMD_0603_RESC1608X55N]  (hidden comment: R)
R5  DB_VALUE: 2.4k  DB_TOLERANCE: 1%  [SMD_0603_RESC1608X55N]  (hidden comment: R)
R6  DB_VALUE: 10k  DB_TOLERANCE: 1%  [SMD_0603_RESC1608X55N]  (hidden comment: R)
R7  R  DB_VALUE: 0R  DB_TOLERANCE: 5%  [SMD_0603_RESC1608X55N]
R8  R  DB_VALUE: 0R  DB_TOLERANCE: 5%  [SMD_0603_RESC1608X55N]
R9  DB_VALUE: 10k  DB_TOLERANCE: 1%  [SMD_0603_RESC1608X55N]  (hidden comment: R)
R10  DB_VALUE: 10k  DB_TOLERANCE: 1%  [SMD_0603_RESC1608X55N]  (hidden comment: R)
R11  DB_VALUE: 0R  DB_TOLERANCE: 1%  [SMD_0603_RESC1608X55N]  (hidden comment: R)
R12  DB_VALUE: 2R  DB_TOLERANCE: 5%  [SMD_1206_RESC3216X65N]  (hidden comment: R)
R13  DB_VALUE: 100R  DB_TOLERANCE: 1%  [SMD_1206_RESC3216X65N]  (hidden comment: R)
R14  DB_VALUE: 0R  DB_TOLERANCE: 1%  [SMD_1206_RESC3216X65N]  (hidden comment: R)
R15  R  DB_VALUE: 0R  DB_TOLERANCE: 1%  [SMD_1206_RESC3216X65N]
R16  DB_VALUE: 4.02k  DB_TOLERANCE: 1%  [SMD_0603_RESC1608X55N]  (hidden comment: R)
R17  DB_VALUE: 30k  DB_TOLERANCE: 1%  [SMD_0603_RESC1608X55N]  (hidden comment: R)
R18  R  DB_VALUE: 0R  DB_TOLERANCE: 5%  [SMD_0603_RESC1608X55N]
R21  R  DB_VALUE: 47k  DB_TOLERANCE: 5%  [SMD_0603_RESC1608X55N]
R26  R  DB_VALUE: 47k  DB_TOLERANCE: 5%  [SMD_0603_RESC1608X55N]
TP2  TEST_POINT_1  [SMD_TP_100-254]  (value not drawn)
TP3  TEST_POINT_1  [SMD_TP_100-254]  (value not drawn)
TP5  TEST_POINT_1  [SMD_TP_100-254]  (value not drawn)
TP6  TEST_POINT_1  [SMD_TP_100-254]  (value not drawn)
TP7  TEST_POINT_1  [SMD_TP_100-254]  (value not drawn)
TP10  TEST_POINT_1  [SMD_TP_100-254]  (value not drawn)
TP11  TEST_POINT_1  [SMD_TP_100-254]  (value not drawn)
TP12  TEST_POINT_1  [SMD_TP_100-254]  (value not drawn)
TP13  TEST_POINT_1  [SMD_TP_100-254]  (value not drawn)
TP21  TEST_POINT_1  [SMD_TP_100-254]  (value not drawn)
U3  IC_DSPIC33EP256MU806-QFN64  DB_VALUE: dsPIC33EP256MU806  [SMD_QFP50P1200X1200X120-64N]
U4  IC_LM2931AD-5.0R2G_SO-8  DB_VALUE: AP78L05SG-13  [SMD_SOIC127P600X175-8N]
U5  IC_TLV70033QDDCRQ1  DB_VALUE: BU33TD3WG-TR  [SMD_SOT95P280X135-5N]
U6  IC_BDXXKA5WF  DB_VALUE: BD33KA5WF-E2  [SMD_SOIC127P620X160-8N]
U7  DB_VALUE: L7805CD2T-TR  [SMD_TO254P1542X460-3_4N]  (hidden comment: IC_IN1OUT3GND4)
U8  IC_VIN1GND4VOUT3  DB_VALUE: MC78M05BDTRKG  [SMD_TO229P991X239-4N_DPAK]
U9  IC_BD00KA5WF  DB_VALUE: BD00KA5WF-E2  [SMD_SOIC127P620X160-8N]
Y1  XTAL  DB_VALUE: 4.00MHz HC49/4HSMX  [SMD_HC49_XTAL1140X480X420N]

### Ports
1V, 3.3V, 5.0V, 12V, GND, PLL_CFG_CLK, PLL_CFG_DAT, PLL_REF_CLK_1, PLL_REF_CLK_2, PWM1H, PWM1L, PWM2H, PWM2L, PWM3H, PWM3L, PWM4H, PWM4L, RESET_COLD_L, SPI_RXD, SPI_SCLK_IN, SPI_SS_IN_L_1, SPI_SS_IN_L_2, SPI_SS_IN_L_3, SPI_SS_IN_L_4, SPI_SS_IN_L_5, SPI_SS_IN_L_6, SPI_SS_IN_L_7, SPI_SS_IN_L_8, SPI_TXD

### Nets
1V: R6.2 ; port 1V
GND: C1.2 C2.2 C3.2 C4.2 C5.2 C6.2 C7.2 C8.2 C9.2 C10.2 C11.2 C12.2 C13.1 C14.2 C15.2 C16.2 C17.2 C18.2 C347.2 D1.1(C) D2.1(C) D3.1(C) D4.1(C) D6.2 D6.5 D9.2(A) J1.3 J2.5 J2.6 J2.7 J2.8 J2.9 J3.2 J4.4 J4.5 J4.6 J5.4 J5.5 J5.6 J6.4 J6.5 J6.6 J7.4 J7.5 J7.6 J8.4 J8.5 J8.6 J9.4 J9.5 J9.6 J10.4 J10.5 J10.6 J11.4 J11.5 J11.6 J12.4 J12.5 J12.6 R5.1 R17.2 R26.2 U3.9(VSS) U3.20(AVSS) U3.25(VSS) U3.41(VSS) U4.2(GND) U4.3(GND) U4.4(N.C.) U4.5(N.C.) U4.6(GND) U4.7(GND) U5.2(GND) U6.6(GND) U6.7(GND) U7.4(GND) U8.4(GND) U9.6(GND) U9.7(GND) ; port GND
3.3V: C4.1 C6.1 C7.1 C8.1 C9.1 C13.2 C14.1 C347.1 J1.2 R9.2 R14.2 R21.1 U3.10(VDD) U3.19(AVDD) U3.26(VDD) U3.35(VUSB3V3) U3.38(VDD) U3.57(VDD) U5.5(OUT) U6.1(OUT) ; port 3.3V
5.0V: C12.1 D5.2(A) D7.1(C) J3.1 R12.1 U4.1(OUTPUT) U7.3(Vout) U8.3(Vout) ; port 5.0V
12V: D8.2(A) D9.1(C) J3.3 J4.1 J4.2 J4.3 J5.1 J5.2 J5.3 J6.1 J6.2 J6.3 J7.1 J7.2 J7.3 J8.1 J8.2 J8.3 J9.1 J9.2 J9.3 J10.1 J10.2 J10.3 J11.1 J11.2 J11.3 J12.1 J12.2 J12.3 R4.1 R13.2 ; port 12V
D+: D6.1 J2.3 U3.37(D+/RG2)
D-: D6.3 J2.2 U3.36(D-/RG3)
FB: C3.1 R6.1 U3.17(PGEC1/AN6/RPI38/RB6)
GREEN: D2.2(A) U3.47(PGED2/SOSCI/C3IN3-/RPI61/RC13)
LDO3.3V-5.0V: R14.1 R15.1 U9.5(CTL) U9.8(VCC)
LDO5.0V: C15.1 D5.1(C) D7.2(A) R11.1 R12.2 R15.2 U5.1(IN) U5.3(EN) U6.5(CTL) U6.8(VCC)
LM12V: D8.1(C) R13.1 U4.8(INPUT) U7.1(Vin) U8.1(Vin)
Main OSC In: C10.1 U3.39(OSC1/RPI60/RC12) Y1.1
Main OSC Out: C11.1 U3.40(OSC2/CLKO/RC15) Y1.2
MCLR: C5.1 J1.1 R9.1 U3.7(~{MCLR})
MCU5.0V: R10.2 U3.34(VBUS)
MCU_REF_CLK_1: R7.1 U3.52(PMWR/RP68/RD4) U3.53(PMRD/RP69/RD5) U3.54(C3IN2-/RP70/RD6) U3.55(C3IN1+/VCMPST3/RP71/RD7)
MCU_REF_CLK_2: R18.1 U3.46(INT0/DMH/RP64/RD0) U3.49(VCPCON/RP65/RD1) U3.50(DPH/RP66/RD2) U3.51(PMBE/RP67/RD3)
MEAS12: C1.1 R4.2 R5.2 U3.18(PGED1/AN7/RCV/RPI39/RB7)
ORANGE: D4.2(A) U3.45(PMCS1/RPI75/RD11)
PGC: J1.5 U3.15(PGEC3/AN1/VREF-/RPI33/RB1)
PGD: J1.4 U3.16(PGED3/AN0/VREF+/RPI32/RB0)
PLL_CFG_CLK: R26.1 U3.59(VCMPST2/RP97/RF1) ; port PLL_CFG_CLK
PLL_CFG_DAT: U3.58(VCMPST1/RP96/RF0) ; port PLL_CFG_DAT
PLL_REF_CLK_1: R7.2 R8.2 ; port PLL_REF_CLK_1
PLL_REF_CLK_2: R8.1 R18.2 ; port PLL_REF_CLK_2
PLL_SUP: C16.1 C17.1 FB5.1 R16.1 U9.1(OUT)
PWM1H: U3.61(AN25/PWM1H/PMD1/RPI81/RE1) ; port PWM1H
PWM1L: U3.60(AN24/PWM1L/PMD0/RP80/RE0) ; port PWM1L
PWM2H: U3.63(AN27/PWM2H/PMD3/RPI83/RE3) ; port PWM2H
PWM2L: U3.62(AN26/PWM2L/PMD2/RP82/RE2) ; port PWM2L
PWM3H: U3.1(AN29/PWM3H/PMD5/RP85/RE5) ; port PWM3H
PWM3L: U3.64(AN28/PWM3L/PMD4/RP84/RE4) ; port PWM3L
PWM4H: U3.3(AN31/PWM4H/PMD7/RP87/RE7) ; port PWM4H
PWM4L: U3.2(AN30/PWM4L/PMD6/RPI86/RE6) ; port PWM4L
RED: D1.2(A) U3.48(PGEC2/SOSCO/C3IN1-/T1CK/RPI62/RC14)
RESET_COLD_L: R21.2 U3.8(C2IN1-/PMA2/RPI121/RG9) ; port RESET_COLD_L
SPI_RXD: U3.6(C2IN3-/SDO2/PMA3/RP120/RG8) ; port SPI_RXD
SPI_SCLK_IN: U3.4(C1IN3-/SCK2/PMA5/RP118/RG6) ; port SPI_SCLK_IN
SPI_SS_IN_L_1: U3.32(SCL2/PMA8/RP101/RF5) ; port SPI_SS_IN_L_1
SPI_SS_IN_L_2: U3.31(SDA2/PMA9/RP100/RF4) ; port SPI_SS_IN_L_2
SPI_SS_IN_L_3: U3.30(AN15/PMA0/RPI47/RB15) ; port SPI_SS_IN_L_3
SPI_SS_IN_L_4: U3.29(AN14/PMA1/RPI46/RB14) ; port SPI_SS_IN_L_4
SPI_SS_IN_L_5: U3.28(TDI/AN13/PMA10/RPI45/RB13) ; port SPI_SS_IN_L_5
SPI_SS_IN_L_6: U3.27(TCK/AN12/PMA11/RPI44/RB12) ; port SPI_SS_IN_L_6
SPI_SS_IN_L_7: U3.24(TDO/AN11/PMA12/RPI43/RB11) ; port SPI_SS_IN_L_7
SPI_SS_IN_L_8: U3.23(TMS/AN10/CVREF/PMA13/RPI42/RB10) ; port SPI_SS_IN_L_8
SPI_TXD: U3.5(C1IN1-/SDI2/PMA4/RPI119/RG7) ; port SPI_TXD
USB5.0V: D6.4 D6.6 J2.1 R10.1 R11.2
VCAP: C2.1 U3.56(VCAP)
VDD_PLL: C18.1 FB5.2 TP2.1
YELLOW: D3.2(A) U3.44(ASCL1/PMCS2/RPI74/RD10)
NetR16_2: R16.2 R17.1 U9.2(ADJ)
NetTP3_1: TP3.1 U3.11(AN5/C1IN1+/VBUSON/VBUSST/RPI37/RB5)
NetTP5_1: TP5.1 U3.12(AN4/C1IN2-/USBOEN/RPI36/RB4)
NetTP6_1: TP6.1 U3.13(AN3/C2IN1+/VPIO/RPI35/RB3)
NetTP7_1: TP7.1 U3.14(AN2/C2IN2-/VMIO/RPI34/RB2)
NetTP10_1: TP10.1 U3.21(AN8/PMA6/RPI40/RB8)
NetTP11_1: TP11.1 U3.22(AN9/PMA7//RPI41/RB9)
NetTP12_1: TP12.1 U3.43(ASDA1/DPLN/RPI73/RD9)
NetTP13_1: TP13.1 U3.42(RTCC/DMLN/RPI72/RD8)
NetTP21_1: TP21.1 U3.33(USBID/RP99/RF3)

Not connected (* = marked no-connect by the designer): J2 4*; U5 4(N.C.)*; U6 2(NC)* 3(NC)* 4(NC)*; U9 3(NC)* 4(NC)*

### Notes on the sheet
- (near U9) BD00KA5WF-E2
- (near FB5) BLM21PG331SN1D-Farenll
- (near C16) 4.02k=0.8505V_output
- (in symbol CON000000048) gnd

### Library data of the parts
C1 C3 = CAP000024113: DB_PART_TYPE: Ceramic_SMD\Standard_X7R; DB_MANUFACTURER_PART: KEMET    C0603C102J3RAC; NOTE: <NOTE>; DB_T_RANGE: -55 to 125; DB_PACKAGE: 0603; DB_DESCRIPTION: C X7R 1nF 5% 25V 0603; DB_APPROVED_ON: 09.10.2010 г.; DB_STATUS: NEW; DB_PART_NUMBER: CAP000024113; DB_PCB_DEVICE: SMD_0603_CAPC1608X95N; DB_DATASHEET: http://john.epiqdesign.com/projects/CIS_Datasheets/F3102_CE_Kemet.pdf?rev=92&sc=0
C2 C12 C15 = CAP000043646: DB_MANUFACTURER_PART: KEMET    C0603C106M9PAC; DB_PART_TYPE: Ceramic_SMD\Standard_X5R; NOTE: <NOTE>; DB_APPROVED_ON: 09.10.2010 г.; DB_DESCRIPTION: C X5R 10uF 20% 6.3V 0603; DB_PACKAGE: 0603; DB_STATUS: NEW; DB_T_RANGE: -55 to 85; DB_PART_NUMBER: CAP000043646; DB_DATASHEET: http://john.epiqdesign.com/projects/CIS_Datasheets/F3102_CE_Kemet.pdf?rev=92&sc=0; DB_PCB_DEVICE: SMD_0603_CAPC1608X95N
C4-C9 C17 C18 = CAP000022751: DB_MANUFACTURER_PART: KEMET    C0402F104M4RAC; DB_PART_TYPE: Ceramic_SMD\Open_Mode_X7R; NOTE: <NOTE>; DB_APPROVED_ON: 09.10.2010 г.; DB_DESCRIPTION: C X7R 100nF 20% 16V 0402; DB_PACKAGE: 0402; DB_STATUS: NEW; DB_T_RANGE: -55 to 125; DB_PART_NUMBER: CAP000022751; DB_DATASHEET: http://john.epiqdesign.com/projects/CIS_Datasheets/F3102_CE_Kemet.pdf?rev=92&sc=0; DB_PCB_DEVICE: SMD_0402_CAPC1005X55N
C10 C11 = CAP000031922: DB_PART_TYPE: Ceramic_SMD\Standard_C0G; DB_MANUFACTURER_PART: KEMET    C0603C180J5GAC; NOTE: <NOTE>; DB_T_RANGE: -55 to 125; DB_PACKAGE: 0603; DB_DESCRIPTION: C C0G 18pF 5% 50V 0603; DB_APPROVED_ON: 09.10.2010 г.; DB_STATUS: NEW; DB_PART_NUMBER: CAP000031922; DB_PCB_DEVICE: SMD_0603_CAPC1608X95N; DB_DATASHEET: http://john.epiqdesign.com/projects/CIS_Datasheets/F3102_CE_Kemet.pdf?rev=92&sc=0
C13 = CAP000047355: as C307-C346 on sheet GS_02_Pow; DB_PART_NUMBER: CAP000047355; DB_PCB_DEVICE: SMD_1210_CAPC3225X279N; DB_DATASHEET: http://john.epiqdesign.com/projects/CIS_Datasheets/CAP_CL32A227MQVNNNE.pdf?rev=1401&sc=0
C14 C16 = CAP000043686: DB_PART_TYPE: Ceramic_SMD\Standard_X5R; DB_MANUFACTURER_PART: KEMET    C0805C226M9PAC; NOTE: <NOTE>; DB_T_RANGE: -55 to 85; DB_PACKAGE: 0805; DB_DESCRIPTION: C X5R 22uF 20% 6.3V 0805; DB_APPROVED_ON: 09.10.2010 г.; DB_STATUS: NEW; DB_PART_NUMBER: CAP000043686; DB_PCB_DEVICE: SMD_0805_CAPC2012X145N; DB_DATASHEET: http://john.epiqdesign.com/projects/CIS_Datasheets/F3102_CE_Kemet.pdf?rev=92&sc=0
C347 = CAP000043344: DB_PART_TYPE: Ceramic_SMD\Standard_X5R; DB_MANUFACTURER_PART: KEMET    C0603C105M9PAC; NOTE: <NOTE>; DB_T_RANGE: -55 to 85; DB_PACKAGE: 0603; DB_DESCRIPTION: C X5R 1uF 20% 6.3V 0603; DB_APPROVED_ON: 09.10.2010 г.; DB_STATUS: NEW; DB_PART_NUMBER: CAP000043344; DB_PCB_DEVICE: SMD_0603_CAPC1608X95N; DB_DATASHEET: http://john.epiqdesign.com/projects/CIS_Datasheets/F3102_CE_Kemet.pdf?rev=92&sc=0
D1-D4 = OPT000000096: DB_MANUFACTURER_PART: KINGBRIGHT       KP-2012CGCK; NOTE: <NOTE>; DB_T_RANGE: -40 to 85; DB_COLOUR: GREEN; DB_PACKAGE: 0805; DB_DESCRIPTION: LED GREEN 0805; DB_APPROVED_BY: VSN; DB_APPROVED_ON: 08.4.2014 г. 09:22:12; DB_STATUS: NEW; DB_PCB_DEVICE: SMD_0805_LED2012X100N; DB_PART_NUMBER: OPT000000096; DB_PART_TYPE: LED; DB_DATASHEET: http://john.epiqdesign.com/projects/CIS_Datasheets/LED_KP-2012CGCK_0805_GREEN.pdf?rev=1359&sc=0
D5 D7 D8 = DDE000000580: DB_PART_TYPE: Schottky; DB_MANUFACTURER_PART: Diodes        B140; NOTE: <NOTE>; DB_T_RANGE: -65 to +150; DB_VOLTAGE: 40V; DB_CURRENT: 1A; DB_PACKAGE: SMA; DB_DESCRIPTION: D B140 SMA; DB_APPROVED_ON: 09.10.2010 г.; DB_STATUS: NEW; DB_PART_NUMBER: DDE000000580; DB_PCB_DEVICE: SMD_DO214AC_SMA
D6 = DDE000002846: DB_PART_TYPE: ESD protection; DB_MANUFACTURER_PART: ON SEMICONDUCTOR        SMS05T1G; DB_T_RANGE: -55 to 150; DB_VOLTAGE: 5V; DB_PACKAGE: SC-74; DB_DESCRIPTION: D SMS05T1G SC-74; DB_APPROVED_BY: VSN; DB_APPROVED_ON: 24.3.2014 г. 10:22:08; DB_STATUS: NEW; DB_PART_NUMBER: DDE000002846; DB_PCB_DEVICE: SMD_SOT457_SOT95P275X110-6N; DB_DATASHEET: http://john.epiqdesign.com/projects/CIS_Datasheets/IC_SMS05T1-D.pdf?rev=1323&sc=0
D9 = DDE000001725: DB_PART_TYPE: TVS; DB_MANUFACTURER_PART: Diodes        SMCJ12A; NOTE: <NOTE>; DB_T_RANGE: -55 to 150; DB_VOLTAGE: 12V; DB_CURRENT: 75A(Max); DB_PACKAGE: SMC; DB_DESCRIPTION: D SMCJ12A SMC; DB_APPROVED_ON: 09.10.2010 г.; DB_STATUS: NEW; DB_PART_NUMBER: DDE000001725; DB_PCB_DEVICE: SMD_DO214AC_SMC
FB5 = IND000000029: DB_PART_TYPE: Inductor; DB_MANUFACTURER_PART: MURATA       BLM21PG221SN1D; NOTE: <NOTE>; DB_TOLERANCE: 25%; DB_T_RANGE: -55 to 125; DB_PACKAGE: 0805; DB_DESCRIPTION: INDUC 220 Ohms 25% 0805; DB_APPROVED_BY: VSN; DB_APPROVED_ON: 30.6.2011 г. 07:59:29; DB_STATUS: NEW; DB_PART_NUMBER: IND000000029; DB_PCB_DEVICE: SMD_0805_INDC2012X105N; DB_DATASHEET: http://john.epiqdesign.com/projects/CIS_Datasheets/BLM21P_MURATA.pdf?rev=325&sc=0
J1 = CON000000006: DB_PART_TYPE: Connector; DB_MANUFACTURER_PART: W+P        143-12-005-00; NOTE: <NOTE>; DB_T_RANGE: -55 to 125; DB_PACKAGE: PTH; DB_DESCRIPTION: CONN PCB 5P M S 143-12-005-00; DB_APPROVED_BY: VSN; DB_APPROVED_ON: 14.12.2010 г. 10:22:07; DB_STATUS: NEW; DB_PART_NUMBER: CON000000006; DB_PCB_DEVICE: PTH_HDRV05W64P254_1X05; DB_DATASHEET: http://john.epiqdesign.com/projects/CIS_Datasheets/143-12-005-00_W+P.pdf?rev=3&sc=0
J2 = CON000000048: DB_PART_TYPE: Connector; DB_MANUFACTURER_PART: CVILUX       CU04-SCM15B0-R0-LF; NOTE: <NOTE>; DB_PINS_NUMBER: 5; DB_PITCH: 0.8; DB_PACKAGE: SMD; DB_DESCRIPTION: CONN  PCB  5P  F  A  USB5 MINI SMD; DB_APPROVED_BY: VSN; DB_APPROVED_ON: 02.5.2011 г. 10:29:38; DB_STATUS: NEW; DB_PART_NUMBER: CON000000048; DB_PCB_DEVICE: SMD_CON-CVILUX-CU04-SCM15B0; DB_DATASHEET: http://john.epiqdesign.com/projects/CIS_Datasheets/USB%20MINI_CVILUX.pdf?rev=249&sc=0
J3 = CON000000272: DB_PART_TYPE: Connector; DB_MANUFACTURER_PART: HOW DER      HD-351-3P; DB_PINS_NUMBER: 3; DB_PITCH: 3.5mm; DB_VOLTAGE: 300VAC; DB_CURRENT: 10A; DB_PACKAGE: PTH; DB_DESCRIPTION: CONN PCB 3P; DB_APPROVED_BY: VSN; DB_APPROVED_ON: 07.5.2014 г. 14:06:04; DB_STATUS: NEW; DB_PART_NUMBER: CON000000272; DB_PCB_DEVICE: PTH_CON_HD-351-3P; DB_DATASHEET: http://john.epiqdesign.com/projects/CIS_Datasheets/CON_hd-351.pdf?rev=1413&sc=0
J4-J12 = CON000000279: DB_PART_TYPE: Connector; DB_MANUFACTURER_PART: WE        	649 006 211 22; DB_PINS_NUMBER: 6; DB_PITCH: 4.2mm; DB_T_RANGE: -40 to 105; DB_VOLTAGE: 600VAC; DB_CURRENT: 6 - 9A; DB_PACKAGE: PTH; DB_DESCRIPTION: CONN PCB 6P M S PTH; DB_APPROVED_BY: VSN; DB_APPROVED_ON: 31.5.2014 г. 08:51:24; DB_STATUS: NEW; DB_PART_NUMBER: CON000000279; DB_PCB_DEVICE: PTH_CON_WR-MRC4-6P_S; DB_DATASHEET: http://john.epiqdesign.com/projects/CIS_Datasheets/CON_6490xx21122.pdf?rev=1438&sc=0
R4 R6 R9 R10 = RES000008663: DB_PART_TYPE: SMD; DB_MANUFACTURER_PART: YAGEO    RC0603FR-0710KL; NOTE: <NOTE>; DB_T_RANGE: -55 to 155; DB_POWER: 1/10W; DB_PACKAGE: 0603; DB_DESCRIPTION: R SMD 10k 1% 1/10W 0603; DB_APPROVED_BY: VSN; DB_APPROVED_ON: 08.8.2011 г. 08:31:51; DB_STATUS: NEW; R_BDS: R; DB_PART_NUMBER: RES000008663; DB_PCB_DEVICE: SMD_0603_RESC1608X55N; DB_DATASHEET: http://john.epiqdesign.com/projects/CIS_Datasheets/PYu-RC0603_51_RoHS_L_4_YAGEO.pdf?rev=138&sc=0
R5 = RES000006261: DB_PART_TYPE: SMD; DB_MANUFACTURER_PART: YAGEO    RC0603FR-072K4; NOTE: <NOTE>; DB_T_RANGE: -55 to 155; DB_POWER: 1/10W; DB_PACKAGE: 0603; DB_DESCRIPTION: R SMD 2K4 1% 1/10W 0603; DB_PRICE: 0.00063; DB_MOQ: 5000; DB_APPROVED_ON: 09.10.2010 г.; DB_STATUS: NEW; R_BDS: R; DB_PART_NUMBER: RES000006261; DB_PCB_DEVICE: SMD_0603_RESC1608X55N; DB_PRICE_DATE: 2010-12-23; DB_DATASHEET: http://john.epiqdesign.com/projects/CIS_Datasheets/PYu-RC0603_51_RoHS_L_4_YAGEO.pdf?rev=138&sc=0
R7 R8 R18 = RES000006349: DB_PART_TYPE: SMD; DB_MANUFACTURER_PART: YAGEO    RC0603JR-070R; NOTE: <NOTE>; DB_T_RANGE: -55 to 155; DB_POWER: 1/10W; DB_PACKAGE: 0603; DB_DESCRIPTION: R SMD 0R 5% 1/10W 0603; DB_PRICE: 0.000364; DB_MOQ: 5000; DB_APPROVED_ON: 09.10.2010 г.; DB_STATUS: NEW; R_BDS: R; DB_PART_NUMBER: RES000006349; DB_PCB_DEVICE: SMD_0603_RESC1608X55N; DB_PRICE_DATE: 2010-12-23; DB_DATASHEET: http://john.epiqdesign.com/projects/CIS_Datasheets/PYu-RC0603_51_RoHS_L_4_YAGEO.pdf?rev=138&sc=0
R11 = RES000008926: DB_PART_TYPE: SMD; DB_MANUFACTURER_PART: YAGEO    AC0603FR-070RL; NOTE: <NOTE>; DB_T_RANGE: -55 to 155; DB_POWER: 1/10W; DB_PACKAGE: 0603; DB_DESCRIPTION: R SMD 0R 1% 1/10W 0603; DB_CERTIFIED: AUT; DB_APPROVED_BY: VSN; DB_APPROVED_ON: 21.5.2013 г. 09:19:53; DB_STATUS: NEW; R_BDS: R; DB_PART_NUMBER: RES000008926; DB_PCB_DEVICE: SMD_0603_RESC1608X55N; DB_DATASHEET: http://john.epiqdesign.com/projects/CIS_Datasheets/RES_AC_YAGEO.pdf?rev=263&sc=0
R12 = RES000007051: DB_PART_TYPE: SMD; DB_MANUFACTURER_PART: YAGEO    RC1206JR-072R; NOTE: <NOTE>; DB_T_RANGE: -55 to 155; DB_POWER: 1/4W; DB_PACKAGE: 1206; DB_DESCRIPTION: R SMD 2R 5% 1/4W 1206; DB_APPROVED_ON: 09.10.2010 г.; DB_STATUS: NEW; R_BDS: R; DB_PART_NUMBER: RES000007051; DB_PCB_DEVICE: SMD_1206_RESC3216X65N; DB_DATASHEET: http://john.epiqdesign.com/projects/CIS_Datasheets/PYu-RC1206_51_RoHS_L_4_YAGEO.pdf?rev=138&sc=0
R13 = RES000006922: DB_PART_TYPE: SMD; DB_MANUFACTURER_PART: YAGEO    RC1206FR-07100R; NOTE: <NOTE>; DB_T_RANGE: -55 to 155; DB_POWER: 1/4W; DB_PACKAGE: 1206; DB_DESCRIPTION: R SMD 100R 1% 1/4W 1206; DB_APPROVED_ON: 09.10.2010 г.; DB_STATUS: NEW; R_BDS: R; DB_PART_NUMBER: RES000006922; DB_PCB_DEVICE: SMD_1206_RESC3216X65N; DB_DATASHEET: http://john.epiqdesign.com/projects/CIS_Datasheets/PYu-RC1206_51_RoHS_L_4_YAGEO.pdf?rev=138&sc=0
R14 R15 = RES000008756: DB_PART_TYPE: SMD; DB_MANUFACTURER_PART: YAGEO    AC1206FR-070RL; NOTE: <NOTE>; DB_T_RANGE: -55 to 155; DB_POWER: 1/4W; DB_PACKAGE: 1206; DB_DESCRIPTION: R SMD 0R 1% 1/4W 1206; DB_CERTIFIED: AUT; DB_APPROVED_BY: VSN; DB_APPROVED_ON: 27.4.2012 г. 12:25:00; DB_STATUS: NEW; R_BDS: R; DB_PART_NUMBER: RES000008756; DB_PCB_DEVICE: SMD_1206_RESC3216X65N; DB_DATASHEET: http://john.epiqdesign.com/projects/CIS_Datasheets/RES_AC_YAGEO.pdf?rev=263&sc=0
R16 = RES000001499: DB_PART_TYPE: SMD; DB_MANUFACTURER_PART: YAGEO    RC0603FR-074K02; NOTE: <NOTE>; DB_T_RANGE: -55 to 155; DB_POWER: 1/10W; DB_PACKAGE: 0603; DB_DESCRIPTION: R SMD 4K02 1% 1/10W 0603; DB_PRICE: 0.00063; DB_MOQ: 5000; DB_APPROVED_ON: 09.10.2010 г.; DB_STATUS: NEW; R_BDS: R; DB_PART_NUMBER: RES000001499; DB_PCB_DEVICE: SMD_0603_RESC1608X55N; DB_PRICE_DATE: 2010-12-23; DB_DATASHEET: http://john.epiqdesign.com/projects/CIS_Datasheets/PYu-RC0603_51_RoHS_L_4_YAGEO.pdf?rev=138&sc=0
R17 = RES000006287: DB_PART_TYPE: SMD; DB_MANUFACTURER_PART: YAGEO    RC0603FR-0730K; NOTE: <NOTE>; DB_T_RANGE: -55 to 155; DB_POWER: 1/10W; DB_PACKAGE: 0603; DB_DESCRIPTION: R SMD 30K 1% 1/10W 0603; DB_PRICE: 0.00063; DB_MOQ: 5000; DB_APPROVED_ON: 09.10.2010 г.; DB_STATUS: NEW; R_BDS: R; DB_PART_NUMBER: RES000006287; DB_PCB_DEVICE: SMD_0603_RESC1608X55N; DB_PRICE_DATE: 2010-12-23; DB_DATASHEET: http://john.epiqdesign.com/projects/CIS_Datasheets/PYu-RC0603_51_RoHS_L_4_YAGEO.pdf?rev=138&sc=0
R21 R26 = RES000006462: DB_PART_TYPE: SMD; DB_MANUFACTURER_PART: YAGEO    RC0603JR-0747K; NOTE: <NOTE>; DB_T_RANGE: -55 to 155; DB_POWER: 1/10W; DB_PACKAGE: 0603; DB_DESCRIPTION: R SMD 47K 5% 1/10W 0603; DB_PRICE: 0.000364; DB_MOQ: 5000; DB_APPROVED_ON: 09.10.2010 г.; DB_STATUS: NEW; R_BDS: R; DB_PART_NUMBER: RES000006462; DB_PCB_DEVICE: SMD_0603_RESC1608X55N; DB_PRICE_DATE: 2010-12-23; DB_DATASHEET: http://john.epiqdesign.com/projects/CIS_Datasheets/PYu-RC0603_51_RoHS_L_4_YAGEO.pdf?rev=138&sc=0
TP2 TP3 TP5-TP7 TP10-TP13 TP21 = TPO000000001: DB_PART_TYPE: Test Point; DB_VALUE: 100_254; DB_DESCRIPTION: Test Point 100_254; DB_APPROVED_ON: 10.9.2010 г.; DB_STATUS: NEW; DB_PART_NUMBER: TPO000000001; DB_DIAMETER: 100_254; DB_PCB_DEVICE: SMD_TP_100-254
U3 = MCU000000070: DB_PART_TYPE: DSP; DB_MANUFACTURER_PART: MICROCHIP        DSPIC33EP256MU806-E/PT; OriginalSymbolOrigin: (30000,20000); < Value >: Type; DeviceNumbering: Alpha; DeviceDesignator: A; DevicesInPackage: 1; IsHeterogeneous: False; DB_T_RANGE: -40 to 125; DB_PACKAGE: TQFP-64; DB_DESCRIPTION: IC dsPIC33EP256MU806 TQFP-64; DB_CERTIFIED: AUT; DB_APPROVED_BY: VSN; DB_APPROVED_ON: 17.7.2012 г. 14:21:28; DB_STATUS: NEW; Package: <Package>; DevicesInView: 1; PackageName: PIC24FJ16GA004_X_PT; DB_PART_NUMBER: MCU000000070; DB_PCB_DEVICE: SMD_QFP50P1200X1200X120-64N; DB_DATASHEET: http://john.epiqdesign.com/projects/CIS_Datasheets/dsPIC33EPxxx-Microchip.pdf?rev=798&sc=0
U4 = PSU000000125: DB_PART_TYPE: Linear Voltage Regulator; DB_MANUFACTURER_PART: DIODES        AP78L05SG-13; DB_T_RANGE: -40 to 125; DB_VOLTAGE: 5V; DB_CURRENT: 100mA; DB_PACKAGE: SOIC-8; DB_DESCRIPTION: IC AP78L05SG-13 SOIC-8; DB_APPROVED_BY: VSN; DB_APPROVED_ON: 07.5.2014 г. 12:58:07; DB_STATUS: NEW; DB_PART_NUMBER: PSU000000125; DB_PCB_DEVICE: SMD_SOIC127P600X175-8N; DB_DATASHEET: http://john.epiqdesign.com/projects/CIS_Datasheets/IC_AP78LXX.pdf?rev=1405&sc=0
U5 = PSU000000126: DB_PART_TYPE: Linear Voltage Regulator; DB_MANUFACTURER_PART: ROHM     BU33TD3WG-TR; DB_T_RANGE: -40 to 85; DB_VOLTAGE: 3.3V; DB_CURRENT: 200mA; DB_DROP_VOLTAGE: 220mV; DB_PACKAGE: SOT23-5; DB_DESCRIPTION: IC BU33TD3WG-TR SOT23-5; DB_APPROVED_BY: VSN; DB_APPROVED_ON: 07.5.2014 г. 13:14:31; DB_STATUS: NEW; DB_PART_NUMBER: PSU000000126; DB_PCB_DEVICE: SMD_SOT95P280X135-5N; DB_DATASHEET: http://john.epiqdesign.com/projects/CIS_Datasheets/IC_BUXXTD3WG-TR.pdf?rev=1407&sc=0
U6 = PSU000000127: DB_PART_TYPE: Linear Voltage Regulator; DB_MANUFACTURER_PART: ROHM        BD33KA5WF-E2; DB_T_RANGE: -40 to 105; DB_VOLTAGE: 3.3V; DB_CURRENT: 500mA; DB_PACKAGE: SOIC-8; DB_DESCRIPTION: IC BD33KA5WF-E2 SOIC-8; DB_APPROVED_BY: VSN; DB_APPROVED_ON: 07.5.2014 г. 13:18:28; DB_STATUS: NEW; DB_PART_NUMBER: PSU000000127; DB_PCB_DEVICE: SMD_SOIC127P620X160-8N; DB_DATASHEET: http://john.epiqdesign.com/projects/CIS_Datasheets/IC_bdxxka5wf-e-209388.pdf?rev=1408&sc=0
U7 = PSU000000129: DB_PART_TYPE: Linear Voltage Regulator; DB_MANUFACTURER_PART: ST       L7805CD2T-TR; NOTE: <NOTE>; DB_T_RANGE: 0 to 125; DB_VOLTAGE: 5V; DB_CURRENT: 1A; DB_PACKAGE: D2PAK; DB_DESCRIPTION: IC  L7805CD2T-TR  D2PAK; DB_APPROVED_BY: VSN; DB_APPROVED_ON: 07.5.2014 г. 13:29:21; DB_STATUS: NEW; DB_PART_NUMBER: PSU000000129; DB_PCB_DEVICE: SMD_TO254P1542X460-3_4N; DB_DATASHEET: http://john.epiqdesign.com/projects/CIS_Datasheets/IC_L7805C.pdf?rev=1409&sc=0
U8 = PSU000000031: DB_PART_TYPE: Linear Voltage Regulator; DB_MANUFACTURER_PART: ON Semiconductor       MC78M05BDTRKG; NOTE: <NOTE>; DB_T_RANGE: -40 to 125; DB_VOLTAGE: 5V; DB_CURRENT: 500mA; DB_DROP_VOLTAGE: 2V; DB_PACKAGE: DPAK; DB_DESCRIPTION: IC  MC78M05BDTRKG  DPAK; DB_APPROVED_BY: VSN; DB_APPROVED_ON: 31.3.2011 г. 10:50:15; DB_STATUS: NEW; DB_PART_NUMBER: PSU000000031; DB_PCB_DEVICE: SMD_TO229P991X239-4N_DPAK; DB_DATASHEET: http://john.epiqdesign.com/projects/CIS_Datasheets/MC78M00-D_ONSEMI.pdf?rev=192&sc=0
U9 = PSU000000128: DB_PART_TYPE: Linear Voltage Regulator; DB_MANUFACTURER_PART: ROHM        BD00KA5WF-E2; DB_T_RANGE: -40 to 105; DB_VOLTAGE: 3.3V; DB_CURRENT: 500mA; DB_PACKAGE: SOIC-8; DB_DESCRIPTION: IC BD00KA5WF-E2 SOIC-8; DB_APPROVED_BY: VSN; DB_APPROVED_ON: 07.5.2014 г. 13:19:57; DB_STATUS: NEW; DB_PART_NUMBER: PSU000000128; DB_PCB_DEVICE: SMD_SOIC127P620X160-8N; DB_DATASHEET: http://john.epiqdesign.com/projects/CIS_Datasheets/IC_bdxxka5wf-e-209388.pdf?rev=1408&sc=0
Y1 = OSC000000012: DB_PART_TYPE: Oscillator; DB_MANUFACTURER_PART: IQD       4.00MHz HC49/4HSMX; NOTE: <NOTE>; DB_ACCURACY: 100ppm; DB_T_RANGE: -10 to 60; DB_FREQUENCY: 4MHz; DB_PACKAGE: SMD; DB_DESCRIPTION: IC  4.00MHz HC49/4HSMX  SMD; DB_APPROVED_BY: VSN; DB_APPROVED_ON: 26.4.2012 г. 15:32:29; DB_STATUS: NEW; DB_PART_NUMBER: OSC000000012; DB_PCB_DEVICE: SMD_HC49_XTAL1140X480X420N; DB_DATASHEET: http://john.epiqdesign.com/projects/CIS_Datasheets/hc49-4hsmx_IQD_oscillators.pdf?rev=713&sc=0